# Altium project S7CAS-PLEIADES-CARTE-MERE_P01.PrjPcb (part 3 of 4)

## Sheet S7CAS-PLEIADES-CARTE-MERE_P01_IO.SchDoc
size Tabloid; DocumentNumber: 10; SheetNumber: 10; SheetTotal: 17; Sheet_Name: IO; Size: 11x17
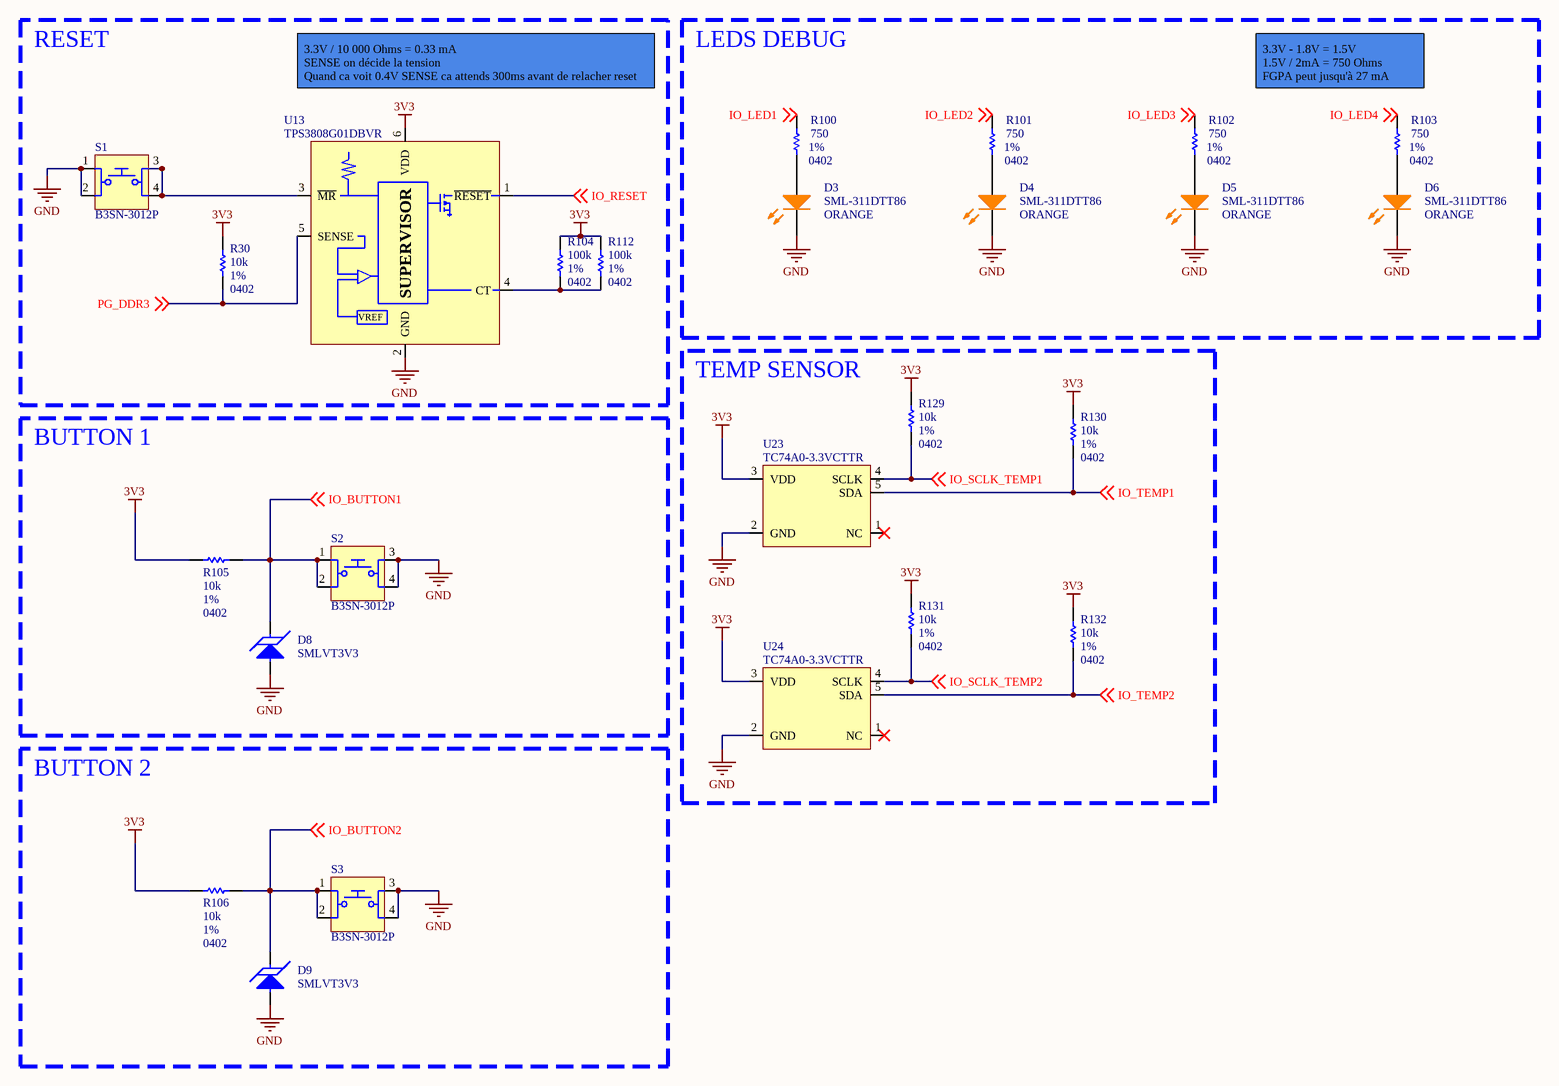
[diagram p9: S7CAS-PLEIADES-CARTE-MERE_P01_IO.SchDoc]

### Parts
D3  SML-311DTT86  value ORANGE  [LED_0603]
D4  SML-311DTT86  value ORANGE  [LED_0603]
D5  SML-311DTT86  value ORANGE  [LED_0603]
D6  SML-311DTT86  value ORANGE  [LED_0603]
D8  SMLVT3V3  [TVS_POW_SMLVT3V3]
D9  SMLVT3V3  [TVS_POW_SMLVT3V3]
R30  value 10k  Package: 0402  Precision: 1%  [RES_0402]  (hidden comment: RES - 0402)
R100  value 750  Package: 0402  Precision: 1%  [RES_0402]  (hidden comment: RES - 0402)
R101  value 750  Package: 0402  Precision: 1%  [RES_0402]  (hidden comment: RES - 0402)
R102  value 750  Package: 0402  Precision: 1%  [RES_0402]  (hidden comment: RES - 0402)
R103  value 750  Package: 0402  Precision: 1%  [RES_0402]  (hidden comment: RES - 0402)
R104  value 100k  Package: 0402  Precision: 1%  [RES_0402]  (hidden comment: RES - 0402)
R105  value 10k  Package: 0402  Precision: 1%  [RES_0402]  (hidden comment: RES - 0402)
R106  value 10k  Package: 0402  Precision: 1%  [RES_0402]  (hidden comment: RES - 0402)
R112  value 100k  Package: 0402  Precision: 1%  [RES_0402]  (hidden comment: RES - 0402)
R129  value 10k  Package: 0402  Precision: 1%  [RES_0402]  (hidden comment: RES - 0402)
R130  value 10k  Package: 0402  Precision: 1%  [RES_0402]  (hidden comment: RES - 0402)
R131  value 10k  Package: 0402  Precision: 1%  [RES_0402]  (hidden comment: RES - 0402)
R132  value 10k  Package: 0402  Precision: 1%  [RES_0402]  (hidden comment: RES - 0402)
S1  B3SN-3012P  [SWI_TACT_B3SN-3012P]
S2  B3SN-3012P  [SWI_TACT_B3SN-3012P]
S3  B3SN-3012P  [SWI_TACT_B3SN-3012P]
U13  TPS3808G01DBVR  [POW_RESET_TPS3808]
U23  TC74A0-3.3VCTTR  [SEN_TEMP_TC74A0-3.3VCTTR]
U24  TC74A0-3.3VCTTR  [SEN_TEMP_TC74A0-3.3VCTTR]

### Blocks framed on the sheet
RESET: R30 R104 R112 S1 U13
LEDS DEBUG: D3-D6 R100-R103
TEMP SENSOR: R129-R132 U23 U24
BUTTON 1: D8 R105 S2
BUTTON 2: D9 R106 S3

### Nets
3V3: R30.2 R104.2 R105.1 R106.1 R112.2 R129.2 R130.2 R131.2 R132.2 U13.6(VDD) U23.3(VDD) U24.3(VDD)  [project net VDD_3V3]
GND: D3.K D4.K D5.K D6.K D8.A D9.A S1.1 S1.2 S2.3 S2.4 S3.3 S3.4 U13.2(GND) U23.2(GND) U24.2(GND)
IO_BUTTON1: D8.K R105.2 S2.1 S2.2 ; off-sheet IO_BUTTON1
IO_BUTTON2: D9.K R106.2 S3.1 S3.2 ; off-sheet IO_BUTTON2
IO_LED1: R100.2 ; off-sheet IO_LED1
IO_LED2: R101.2 ; off-sheet IO_LED2
IO_LED3: R102.2 ; off-sheet IO_LED3
IO_LED4: R103.2 ; off-sheet IO_LED4
IO_RESET: U13.1(~{RESET}) ; off-sheet IO_RESET  [project net PROGRAM_B]
IO_SCLK_TEMP1: R129.1 U23.4(SCLK) ; off-sheet IO_SCLK_TEMP1
IO_SCLK_TEMP2: R131.1 U24.4(SCLK) ; off-sheet IO_SCLK_TEMP2
IO_TEMP1: R130.1 U23.5(SDA) ; off-sheet IO_TEMP1
IO_TEMP2: R132.1 U24.5(SDA) ; off-sheet IO_TEMP2
PG_DDR3: R30.1 U13.5(SENSE) ; off-sheet PG_DDR3
NetD3_A: D3.A R100.1
NetD4_A: D4.A R101.1
NetD5_A: D5.A R102.1
NetD6_A: D6.A R103.1
NetR104_1: R104.1 R112.1 U13.4(CT)
NetS1_3: S1.3 S1.4 U13.3(~{MR})

Not connected (* = marked no-connect by the designer): U23 1(NC)*; U24 1(NC)*

### Notes on the sheet
- 3.3V / 10 000 Ohms = 0.33 mA
  SENSE on décide la tension
  Quand ca voit 0.4V SENSE ca attends 300ms avant de relacher reset
- (near R103) 3.3V - 1.8V = 1.5V
  1.5V / 2mA = 750 Ohms
  FGPA peut jusqu'à 27 mA
- Sheet Name
- Project Title
- Global Project
- Size
- Group
- Revision
- Date
- Sheet
- of
- Filename
- Designers
- (in symbol POW_RESET_TPS3808G01DBVR) SUPERVISOR; VREF

### Library data of the parts
D3-D6 = LED_SML-311DTT86: LED - 611nM ORANGE 2mA - 0603; Voltage: 1.8V; Mfg: ROHM Semiconductor; Power: 44mW; Current: 2mA; HelpURL: http://media.digikey.com/pdf/Data%20Sheets/Rohm%20PDFs/SML-311%20Series.pdf; CreatedBy: Jonathan Bouchard; Temperature: -40°C to 85°C; Package: 0603; Precision: *; Mfg Part Number: SML-311DTT86; Supplier 1: Digikey; Supplier Part Number 1: 511-1303-1-ND
D8 D9 = TVS_POW_SMLVT3V3: TVS - 3.3V 10.3V 600W - DO214AA; Manufacturer #1: STMicroelectronics; Value: Vbr = 4.1V -  Clamp = 10.3V; Voltage Rating: 3.3V Standoff; Current Rating: 200A (Ifsm); Power Max: 600W (Ppp); GRAMS Lib Spec: 2.8; Magnetic Material: UNKNOWN; Polarized: YES; Tolerance: *; HelpURL: https://www.st.com/content/ccc/resource/technical/document/datasheet/da/a4/86/90/17/13/47/7c/CD00000923.pdf/files/CD00000923.pdf/jcr:content/translations/en.CD00000923.pdf; CreatedBy/Date: Jonathan Bouchard - 2019-04-27; VerifiedBy: Nicolas V. (2019-05-06); Temperature: -55°C ~ 175°C (TJ); Package: DO214AA; Manufacturer #2: *; Part Number #2: *; Part Number #1: SMLVT3V3; Supplier 1: Digi-Key; Supplier Part Number 1: 497-2496-1-ND; Cryo: UNKNOWN; Mfg Part Number: SMLVT3V3
R30 R105 R106 R129-R132 = RES - 0402: as R31 on sheet S7CAS-PLEIADES-CARTE-MERE_P01_DDR3; Current: *; CreatedBy: Jonathan Bouchard; Power: 1/16W; Part Number #1: RMCF0402FT10K0
R100-R103 = RES - 0402: 750 Ohms ±0.1% 0.063W, 1/16W Chip Resistor 0402 (1005 Metric) Automotive AEC-Q200 Thin Film; Mfg Part Number: ERA-2ARB751X; Voltage: 50V; Mfg: Panasonic Electronic Components; Current: *; CreatedBy: Jonathan Bouchard; Power: 1/16W
R104 R112 = RES - 0402: 100 kOhms ±1% 0.063W, 1/16W Chip Resistor 0402 (1005 Metric) Moisture Resistant Thick Film; Mfg Part Number: RC0402FR-07100KL; Voltage: 75V; Current: *; CreatedBy: Jonathan Bouchard; Power: 1/16W; Part Number #1: RC0402FR-07100KL
S1-S3 = SWI_TACT_B3SN-3012P_1: SWI - SWITCH TACTILE SPST-NO 0.05A 24V -SMD; Manufacturer #1: Omron Electronics Inc-EMC Div; Current Rating: 50mA; Voltage rating: 24VDC; Polarized: No; Magnetic Material: UNKNOWN; GRAMS Lib Spec: 2.8; Manufacturer #2: *; Power Max: *; Value: SPST-NO; Part Number #1: B3SN-3012P; Part Number #2: *; HelpURL: http://omronfs.omron.com/en_US/ecb/products/pdf/en-b3sn.pdf; Supplier 1: Digi-Key; Supplier Part Number 1: SW261CT-ND; Temperature: -25°C ~ 70°C; Package: SMD; CreatedBy/Date: Olivier Bernard / 5/12/2017; Tolerance: *; VerifiedBy: Caroline Paulin / 11 juillet 2018; Cryo: UNKNOWN; Mfg Part Number: B3SN-3012P
U13 = POW_RESET_TPS3808G01DBVR: POW - VOLT SUPERVISOR ADJ - SOT23-6; Mfg: Texas Instruments; Voltage: *; Current: *; Power: *; Mfg Part Number: TPS3808G01DBVR; HelpURL: http://www.ti.com/lit/ds/symlink/tps3808.pdf; CreatedBy: Jonathan Bouchard; Temperature: -40°C ~ 125°C (TJ); Value: *; Precision: *; Package: SOT23-6; Supplier 1: Digikey; Supplier Part Number 1: 296-17188-6-ND
U23 U24 = SENS_TEMP_TC74A0-3.3VCTTR: SENS - TEMPERATURE SENSOR I2C/SMBUS - SOT23-5; Voltage: 2.7 V ~ 5.5 V; Mfg: Microchip; Precision: ±2°C (±3°C); Current: *; Power: *; Mfg Part Number: TC74A0-3.3VCTTR; HelpURL: http://ww1.microchip.com/downloads/en/DeviceDoc/21462D.pdf; CreatedBy: Jonathan Bouchard; Temperature: -40°C ~ 125°C; Value: *; Package: SOT23-5; Supplier 1: Digikey; Supplier Part Number 1: TC74A0-3.3VCTDKR-ND

## Sheet S7CAS-PLEIADES-CARTE-MERE_P01_FPGA-BANK0.SchDoc
size Tabloid; DocumentNumber: 11; SheetNumber: 11; SheetTotal: 17; Sheet_Name: FPGA - BANK 0; Size: 11x17
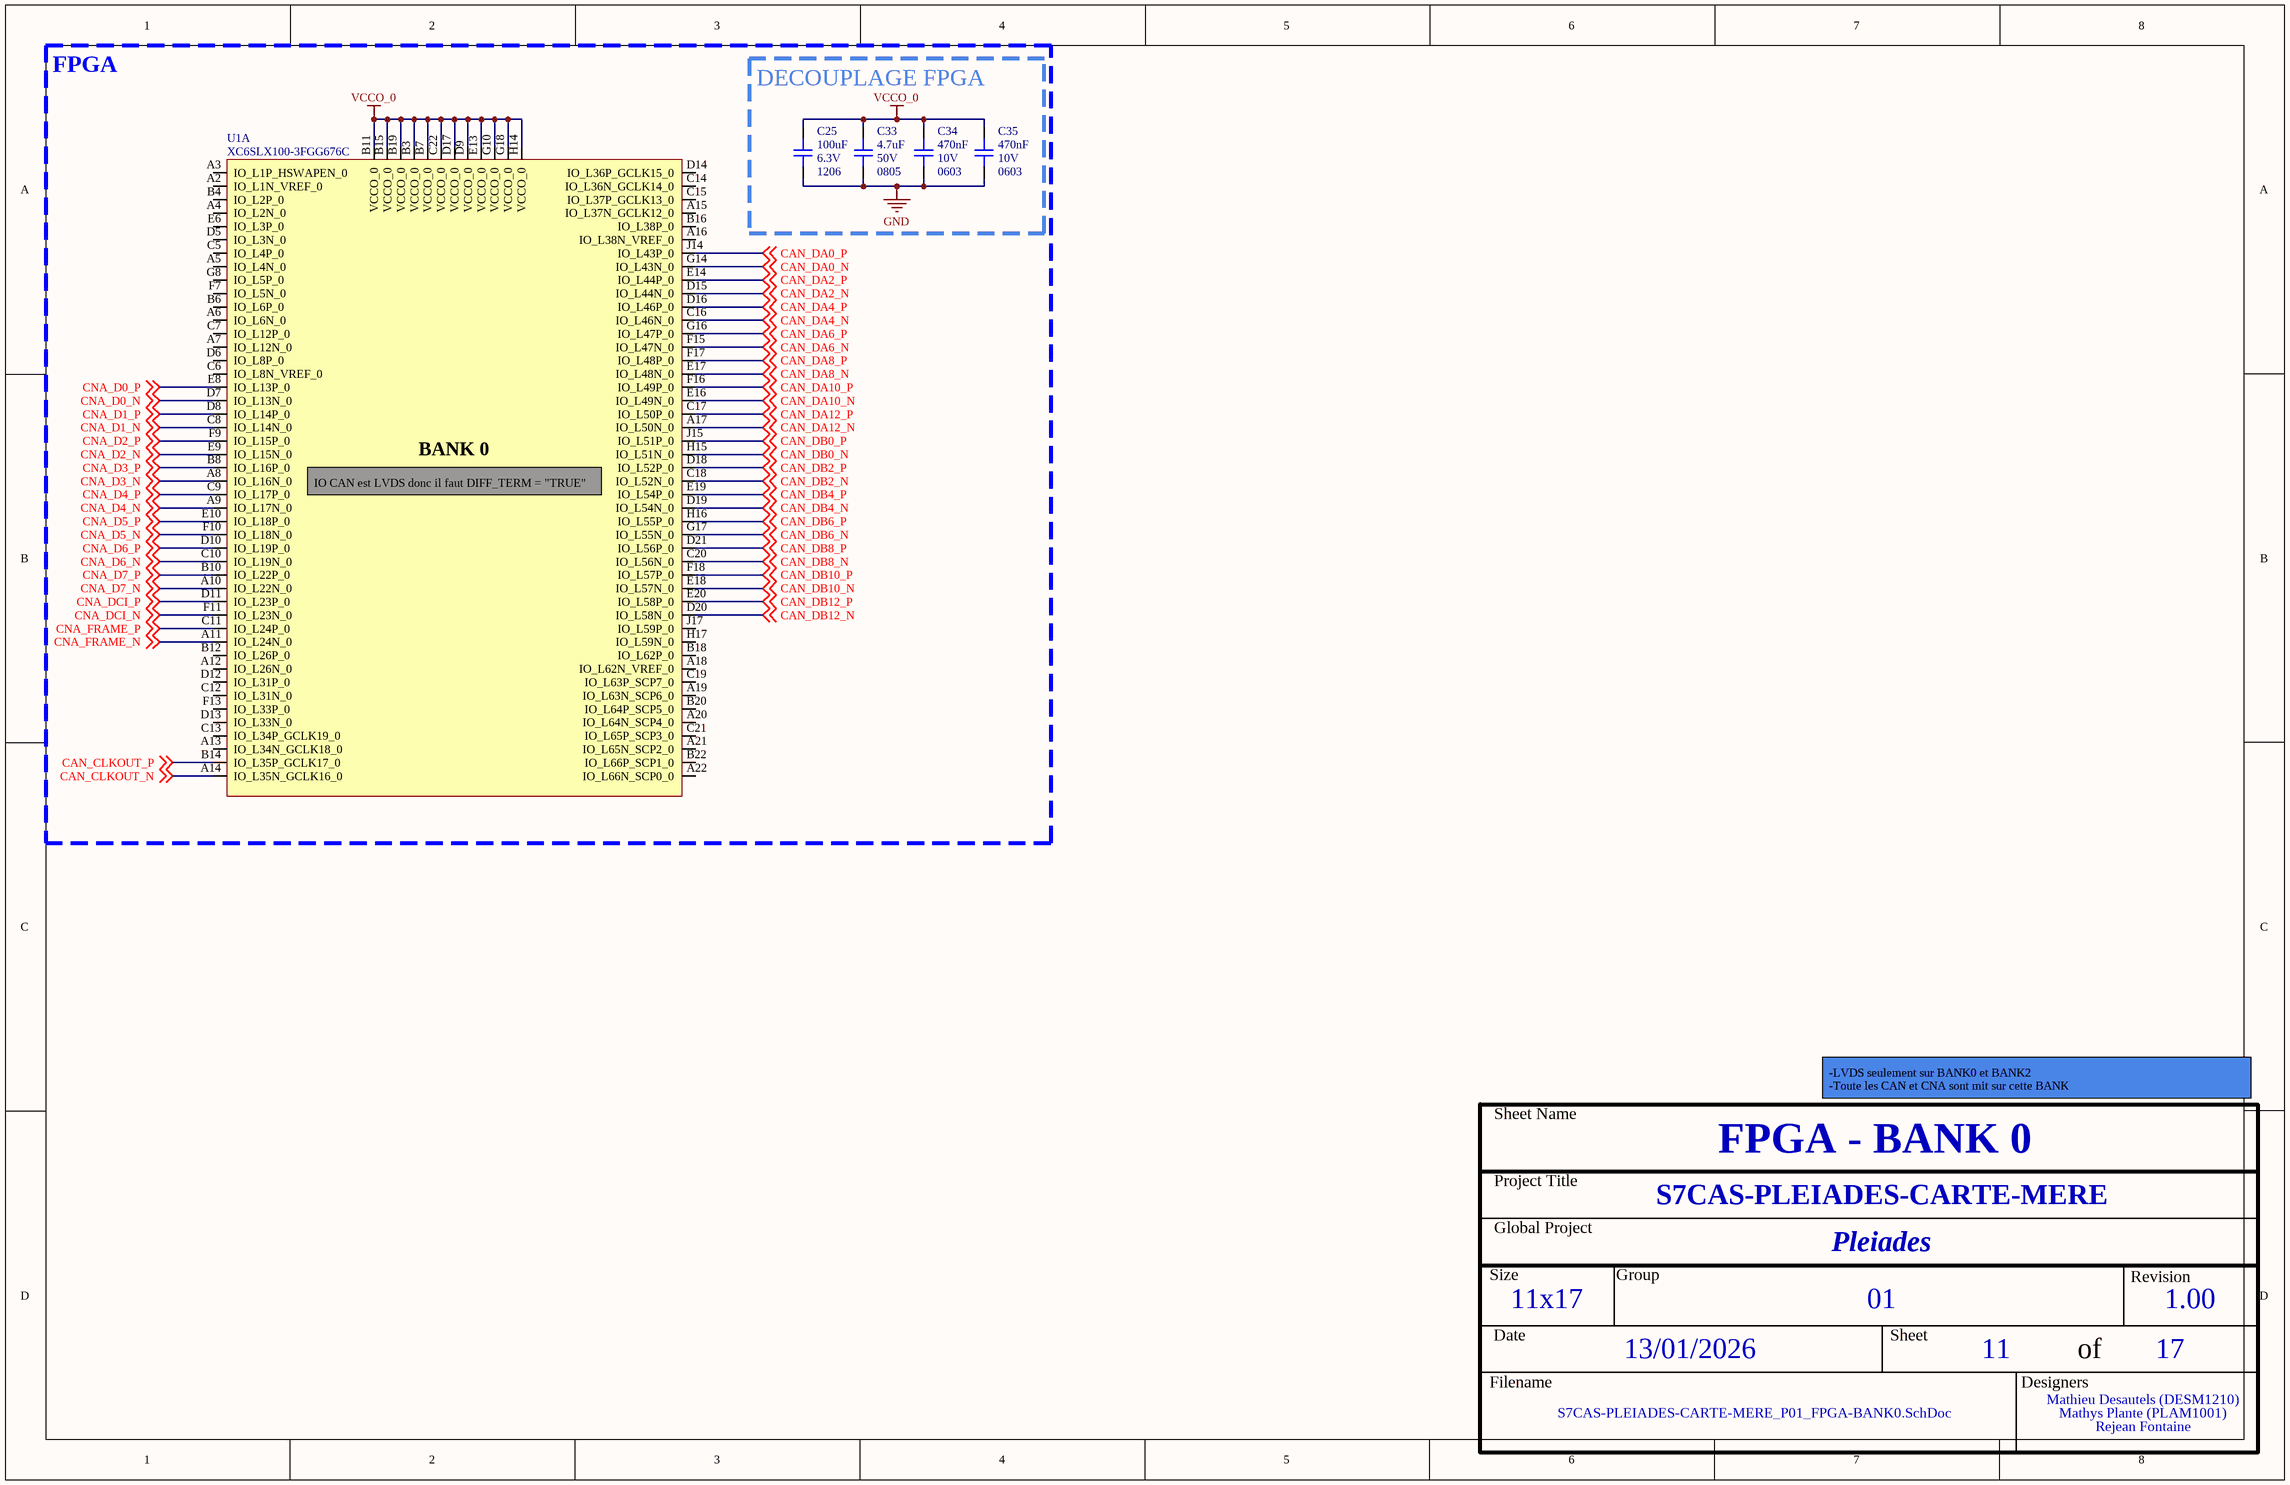
[diagram p10: S7CAS-PLEIADES-CARTE-MERE_P01_FPGA-BANK0.SchDoc]

### Parts
C25  value 100uF  Voltage: 6.3V  Package: 1206  [CAP_1206]  (hidden comment: CAP - 1206)
C33  value 4.7uF  Voltage: 50V  Package: 0805  [CAP_0805]  (hidden comment: CAP - 0805)
C34  value 470nF  Voltage: 10V  Package: 0603  [CAP_0603]  (hidden comment: CAP - 0603)
C35  value 470nF  Voltage: 10V  Package: 0603  [CAP_0603]  (hidden comment: CAP - 0603)
U1  XC6SLX100-3FGG676C  [FPGA_XILINX_FGG676]  (part A of 10)

### Blocks framed on the sheet
FPGA: U1
DECOUPLAGE FPGA: C25 C33-C35

### Nets
GND: C25.1 C33.1 C34.1 C35.1
VCCO_0: C25.2 C33.2 C34.2 C35.2 U1.B3(VCCO_0) U1.B7(VCCO_0) U1.B11(VCCO_0) U1.B15(VCCO_0) U1.B19(VCCO_0) U1.C22(VCCO_0) U1.D9(VCCO_0) U1.D17(VCCO_0) U1.E13(VCCO_0) U1.G10(VCCO_0) U1.G18(VCCO_0) U1.H14(VCCO_0)  [project net VDD_3V3]
CAN_CLKOUT_N: U1.A14(IO_L35N_GCLK16_0) ; off-sheet CAN_CLKOUT_N
CAN_CLKOUT_P: U1.B14(IO_L35P_GCLK17_0) ; off-sheet CAN_CLKOUT_P
CAN_DA0_N: U1.G14(IO_L43N_0) ; off-sheet CAN_DA0_N
CAN_DA0_P: U1.J14(IO_L43P_0) ; off-sheet CAN_DA0_P
CAN_DA2_N: U1.D15(IO_L44N_0) ; off-sheet CAN_DA2_N
CAN_DA2_P: U1.E14(IO_L44P_0) ; off-sheet CAN_DA2_P
CAN_DA4_N: U1.C16(IO_L46N_0) ; off-sheet CAN_DA4_N
CAN_DA4_P: U1.D16(IO_L46P_0) ; off-sheet CAN_DA4_P
CAN_DA6_N: U1.F15(IO_L47N_0) ; off-sheet CAN_DA6_N
CAN_DA6_P: U1.G16(IO_L47P_0) ; off-sheet CAN_DA6_P
CAN_DA8_N: U1.E17(IO_L48N_0) ; off-sheet CAN_DA8_N
CAN_DA8_P: U1.F17(IO_L48P_0) ; off-sheet CAN_DA8_P
CAN_DA10_N: U1.E16(IO_L49N_0) ; off-sheet CAN_DA10_N
CAN_DA10_P: U1.F16(IO_L49P_0) ; off-sheet CAN_DA10_P
CAN_DA12_N: U1.A17(IO_L50N_0) ; off-sheet CAN_DA12_N
CAN_DA12_P: U1.C17(IO_L50P_0) ; off-sheet CAN_DA12_P
CAN_DB0_N: U1.H15(IO_L51N_0) ; off-sheet CAN_DB0_N
CAN_DB0_P: U1.J15(IO_L51P_0) ; off-sheet CAN_DB0_P
CAN_DB2_N: U1.C18(IO_L52N_0) ; off-sheet CAN_DB2_N
CAN_DB2_P: U1.D18(IO_L52P_0) ; off-sheet CAN_DB2_P
CAN_DB4_N: U1.D19(IO_L54N_0) ; off-sheet CAN_DB4_N
CAN_DB4_P: U1.E19(IO_L54P_0) ; off-sheet CAN_DB4_P
CAN_DB6_N: U1.G17(IO_L55N_0) ; off-sheet CAN_DB6_N
CAN_DB6_P: U1.H16(IO_L55P_0) ; off-sheet CAN_DB6_P
CAN_DB8_N: U1.C20(IO_L56N_0) ; off-sheet CAN_DB8_N
CAN_DB8_P: U1.D21(IO_L56P_0) ; off-sheet CAN_DB8_P
CAN_DB10_N: U1.E18(IO_L57N_0) ; off-sheet CAN_DB10_N
CAN_DB10_P: U1.F18(IO_L57P_0) ; off-sheet CAN_DB10_P
CAN_DB12_N: U1.D20(IO_L58N_0) ; off-sheet CAN_DB12_N
CAN_DB12_P: U1.E20(IO_L58P_0) ; off-sheet CAN_DB12_P
CNA_D0_N: U1.D7(IO_L13N_0) ; off-sheet CNA_D0_N
CNA_D0_P: U1.E8(IO_L13P_0) ; off-sheet CNA_D0_P
CNA_D1_N: U1.C8(IO_L14N_0) ; off-sheet CNA_D1_N
CNA_D1_P: U1.D8(IO_L14P_0) ; off-sheet CNA_D1_P
CNA_D2_N: U1.E9(IO_L15N_0) ; off-sheet CNA_D2_N
CNA_D2_P: U1.F9(IO_L15P_0) ; off-sheet CNA_D2_P
CNA_D3_N: U1.A8(IO_L16N_0) ; off-sheet CNA_D3_N
CNA_D3_P: U1.B8(IO_L16P_0) ; off-sheet CNA_D3_P
CNA_D4_N: U1.A9(IO_L17N_0) ; off-sheet CNA_D4_N
CNA_D4_P: U1.C9(IO_L17P_0) ; off-sheet CNA_D4_P
CNA_D5_N: U1.F10(IO_L18N_0) ; off-sheet CNA_D5_N
CNA_D5_P: U1.E10(IO_L18P_0) ; off-sheet CNA_D5_P
CNA_D6_N: U1.C10(IO_L19N_0) ; off-sheet CNA_D6_N
CNA_D6_P: U1.D10(IO_L19P_0) ; off-sheet CNA_D6_P
CNA_D7_N: U1.A10(IO_L22N_0) ; off-sheet CNA_D7_N
CNA_D7_P: U1.B10(IO_L22P_0) ; off-sheet CNA_D7_P
CNA_DCI_N: U1.F11(IO_L23N_0) ; off-sheet CNA_DCI_N
CNA_DCI_P: U1.D11(IO_L23P_0) ; off-sheet CNA_DCI_P
CNA_FRAME_N: U1.A11(IO_L24N_0) ; off-sheet CNA_FRAME_N
CNA_FRAME_P: U1.C11(IO_L24P_0) ; off-sheet CNA_FRAME_P

Not connected (* = marked no-connect by the designer): U1 A2(IO_L1N_VREF_0) A3(IO_L1P_HSWAPEN_0) A4(IO_L2N_0) A5(IO_L4N_0) A6(IO_L6N_0) A7(IO_L12N_0) A12(IO_L26N_0) A13(IO_L34N_GCLK18_0) A15(IO_L37N_GCLK12_0) A16(IO_L38N_VREF_0) A18(IO_L62N_VREF_0) A19(IO_L63N_SCP6_0) A20(IO_L64N_SCP4_0) A21(IO_L65N_SCP2_0) A22(IO_L66N_SCP0_0) B4(IO_L2P_0) B6(IO_L6P_0) B12(IO_L26P_0) B16(IO_L38P_0) B18(IO_L62P_0) B20(IO_L64P_SCP5_0) B22(IO_L66P_SCP1_0) C5(IO_L4P_0) C6(IO_L8N_VREF_0) C7(IO_L12P_0) C12(IO_L31N_0) C13(IO_L34P_GCLK19_0) C14(IO_L36N_GCLK14_0) C15(IO_L37P_GCLK13_0) C19(IO_L63P_SCP7_0) C21(IO_L65P_SCP3_0) D5(IO_L3N_0) D6(IO_L8P_0) D12(IO_L31P_0) D13(IO_L33N_0) D14(IO_L36P_GCLK15_0) E6(IO_L3P_0) F7(IO_L5N_0) F13(IO_L33P_0) G8(IO_L5P_0) H17(IO_L59N_0) J17(IO_L59P_0)

### Notes on the sheet
- (near U1) IO CAN est LVDS donc il faut DIFF_TERM = "TRUE"
- -LVDS seulement sur BANK0 et BANK2
  -Toute les CAN et CNA sont mit sur cette BANK
- Sheet Name
- Project Title
- Global Project
- Size
- Group
- Revision
- Date
- Sheet
- of
- Filename
- Designers
- (in symbol FPGA_XC6SLX100-3FGG676C, part A) BANK 0

### Library data of the parts
C25 = CAP - 1206: 100 µF ±20% 6.3V Ceramic Capacitor X6T 1206 (3216 Metric); Mfg Part Number: GRM31CD80J107MEA8K; Mfg: Murata Electronics; Current: *; CreatedBy: Jonathan Bouchard; Power: *; Precision: 20%
C33 = CAP - 0805: as C117 on sheet S7CAS-PLEIADES-CARTE-MERE_P01_DDR3; Current: *; CreatedBy: Jonathan Bouchard; Power: *; Precision: 10%
C34 C35 = CAP - 0603: Mfg Part Number: C0603X474K8RAC; Precision: 10%; Current: *; CreatedBy: Jonathan Bouchard; Power: *
U1 = FPGA_XC6SLX100-3FGG676C: FPGA - XILINX SPARTAN 6 480 I/O - BGA-676; Voltage: 1.14 V ~ 1.26 V; Current: *; Power: *; Mfg: Xilinx; Mfg Part Number: XC6SLX100-3FGG676C; HelpURL: https://www.xilinx.com/support/documentation/data_sheets/ds162.pdf; CreatedBy: Jonathan Bouchard; Temperature: 0°C ~ 85°C (TJ); Value: *; Precision: *; Package: BGA-676; Supplier 1: Digikey; Supplier Part Number 1: 122-1760-ND; Part Number #1: XC6SLX100-3FGG676C

## Sheet S7CAS-PLEIADES-CARTE-MERE_P01_FPGA-BANK1.SchDoc
size Tabloid; DocumentNumber: 12; SheetNumber: 12; SheetTotal: 17; Sheet_Name: FPGA - BANK 1; Size: 11x17
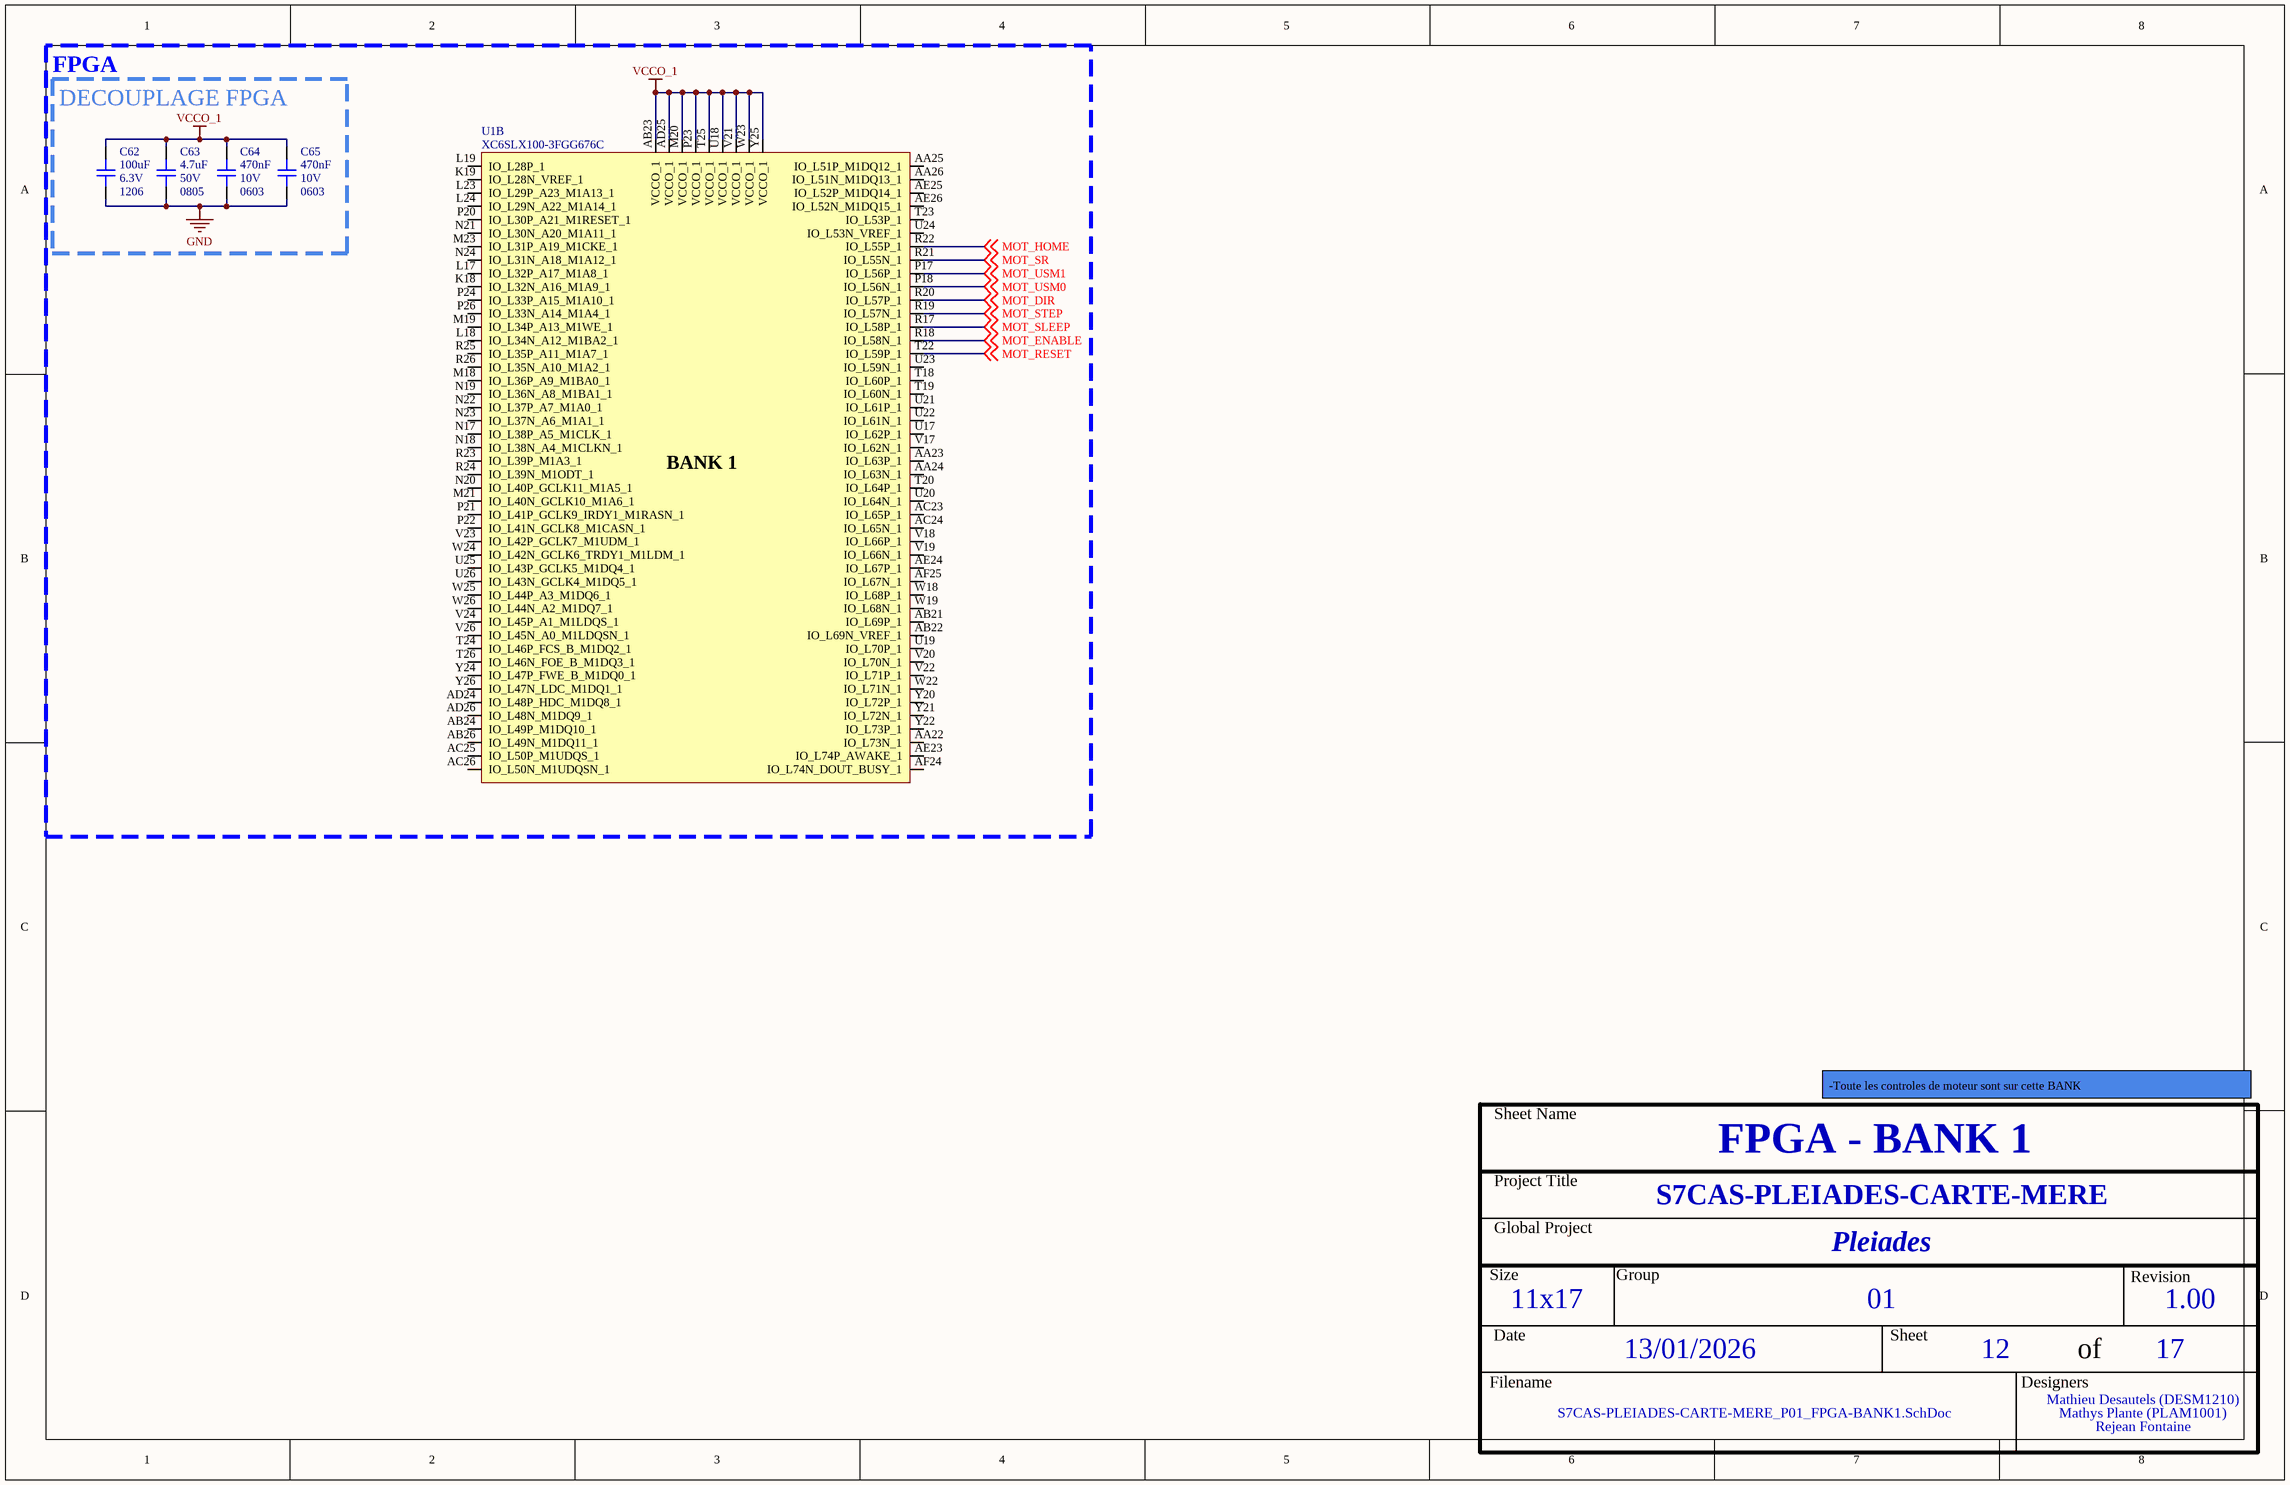
[diagram p11: S7CAS-PLEIADES-CARTE-MERE_P01_FPGA-BANK1.SchDoc]

### Parts
C62  value 100uF  Voltage: 6.3V  Package: 1206  [CAP_1206]  (hidden comment: CAP - 1206)
C63  value 4.7uF  Voltage: 50V  Package: 0805  [CAP_0805]  (hidden comment: CAP - 0805)
C64  value 470nF  Voltage: 10V  Package: 0603  [CAP_0603]  (hidden comment: CAP - 0603)
C65  value 470nF  Voltage: 10V  Package: 0603  [CAP_0603]  (hidden comment: CAP - 0603)
U1  XC6SLX100-3FGG676C  [FPGA_XILINX_FGG676]  (part B of 10)

### Nets
GND: C62.1 C63.1 C64.1 C65.1
VCCO_1: C62.2 C63.2 C64.2 C65.2 U1.AB23(VCCO_1) U1.AD25(VCCO_1) U1.M20(VCCO_1) U1.P23(VCCO_1) U1.T25(VCCO_1) U1.U18(VCCO_1) U1.V21(VCCO_1) U1.W23(VCCO_1) U1.Y25(VCCO_1)  [project net VDD_3V3]
MOT_DIR: U1.R20(IO_L57P_1) ; off-sheet MOT_DIR
MOT_ENABLE: U1.R18(IO_L58N_1) ; off-sheet MOT_ENABLE
MOT_HOME: U1.R22(IO_L55P_1) ; off-sheet MOT_HOME
MOT_RESET: U1.T22(IO_L59P_1) ; off-sheet MOT_RESET
MOT_SLEEP: U1.R17(IO_L58P_1) ; off-sheet MOT_SLEEP
MOT_SR: U1.R21(IO_L55N_1) ; off-sheet MOT_SR
MOT_STEP: U1.R19(IO_L57N_1) ; off-sheet MOT_STEP
MOT_USM0: U1.P18(IO_L56N_1) ; off-sheet MOT_USM0
MOT_USM1: U1.P17(IO_L56P_1) ; off-sheet MOT_USM1

Not connected (* = marked no-connect by the designer): U1 AA22(IO_L73N_1) AA23(IO_L63P_1) AA24(IO_L63N_1) AA25(IO_L51P_M1DQ12_1) AA26(IO_L51N_M1DQ13_1) AB21(IO_L69P_1) AB22(IO_L69N_VREF_1) AB24(IO_L49P_M1DQ10_1) AB26(IO_L49N_M1DQ11_1) AC23(IO_L65P_1) AC24(IO_L65N_1) AC25(IO_L50P_M1UDQS_1) AC26(IO_L50N_M1UDQSN_1) AD24(IO_L48P_HDC_M1DQ8_1) AD26(IO_L48N_M1DQ9_1) AE23(IO_L74P_AWAKE_1) AE24(IO_L67P_1) AE25(IO_L52P_M1DQ14_1) AE26(IO_L52N_M1DQ15_1) AF24(IO_L74N_DOUT_BUSY_1) AF25(IO_L67N_1) K18(IO_L32N_A16_M1A9_1) K19(IO_L28N_VREF_1) L17(IO_L32P_A17_M1A8_1) L18(IO_L34N_A12_M1BA2_1) L19(IO_L28P_1) L23(IO_L29P_A23_M1A13_1) L24(IO_L29N_A22_M1A14_1) M18(IO_L36P_A9_M1BA0_1) M19(IO_L34P_A13_M1WE_1) M21(IO_L40N_GCLK10_M1A6_1) M23(IO_L31P_A19_M1CKE_1) N17(IO_L38P_A5_M1CLK_1) N18(IO_L38N_A4_M1CLKN_1) N19(IO_L36N_A8_M1BA1_1) N20(IO_L40P_GCLK11_M1A5_1) N21(IO_L30N_A20_M1A11_1) N22(IO_L37P_A7_M1A0_1) N23(IO_L37N_A6_M1A1_1) N24(IO_L31N_A18_M1A12_1) P20(IO_L30P_A21_M1RESET_1) P21(IO_L41P_GCLK9_IRDY1_M1RASN_1) P22(IO_L41N_GCLK8_M1CASN_1) P24(IO_L33P_A15_M1A10_1) P26(IO_L33N_A14_M1A4_1) R23(IO_L39P_M1A3_1) R24(IO_L39N_M1ODT_1) R25(IO_L35P_A11_M1A7_1) R26(IO_L35N_A10_M1A2_1) T18(IO_L60P_1) T19(IO_L60N_1) T20(IO_L64P_1) T23(IO_L53P_1) T24(IO_L46P_FCS_B_M1DQ2_1) T26(IO_L46N_FOE_B_M1DQ3_1) U17(IO_L62P_1) U19(IO_L70P_1) U20(IO_L64N_1) U21(IO_L61P_1) U22(IO_L61N_1) U23(IO_L59N_1) U24(IO_L53N_VREF_1) U25(IO_L43P_GCLK5_M1DQ4_1) U26(IO_L43N_GCLK4_M1DQ5_1) V17(IO_L62N_1) V18(IO_L66P_1) V19(IO_L66N_1) V20(IO_L70N_1) V22(IO_L71P_1) V23(IO_L42P_GCLK7_M1UDM_1) V24(IO_L45P_A1_M1LDQS_1) V26(IO_L45N_A0_M1LDQSN_1) W18(IO_L68P_1) W19(IO_L68N_1) W22(IO_L71N_1) W24(IO_L42N_GCLK6_TRDY1_M1LDM_1) W25(IO_L44P_A3_M1DQ6_1) W26(IO_L44N_A2_M1DQ7_1) Y20(IO_L72P_1) Y21(IO_L72N_1) Y22(IO_L73P_1) Y24(IO_L47P_FWE_B_M1DQ0_1) Y26(IO_L47N_LDC_M1DQ1_1)

### Notes on the sheet
- FPGA
- DECOUPLAGE FPGA
- -Toute les controles de moteur sont sur cette BANK
- Sheet Name
- Project Title
- Global Project
- Size
- Group
- Revision
- Date
- Sheet
- of
- Filename
- Designers
- (in symbol FPGA_XC6SLX100-3FGG676C, part B) BANK 1

### Library data of the parts
C62 = CAP - 1206: as C25 on sheet S7CAS-PLEIADES-CARTE-MERE_P01_FPGA-BANK0; Current: *; CreatedBy: Jonathan Bouchard; Power: *; Precision: 20%
C63 = CAP - 0805: as C117 on sheet S7CAS-PLEIADES-CARTE-MERE_P01_DDR3; Current: *; CreatedBy: Jonathan Bouchard; Power: *; Precision: 10%
C64 C65 = CAP - 0603: as C34 on sheet S7CAS-PLEIADES-CARTE-MERE_P01_FPGA-BANK0; Current: *; CreatedBy: Jonathan Bouchard; Power: *
U1 = FPGA_XC6SLX100-3FGG676C: as U1 on sheet S7CAS-PLEIADES-CARTE-MERE_P01_FPGA-BANK0; Current: *; Power: *; Mfg: Xilinx; Mfg Part Number: XC6SLX100-3FGG676C; HelpURL: https://www.xilinx.com/support/documentation/data_sheets/ds162.pdf; CreatedBy: Jonathan Bouchard; Temperature: 0°C ~ 85°C (TJ); Value: *; Precision: *; Package: BGA-676; Supplier 1: Digikey; Supplier Part Number 1: 122-1760-ND; Part Number #1: XC6SLX100-3FGG676C

## Sheet S7CAS-PLEIADES-CARTE-MERE_P01_FPGA-BANK2.SchDoc
size Tabloid; DocumentNumber: 13; SheetNumber: 13; SheetTotal: 17; Sheet_Name: FPGA - BANK 2; Size: 11x17
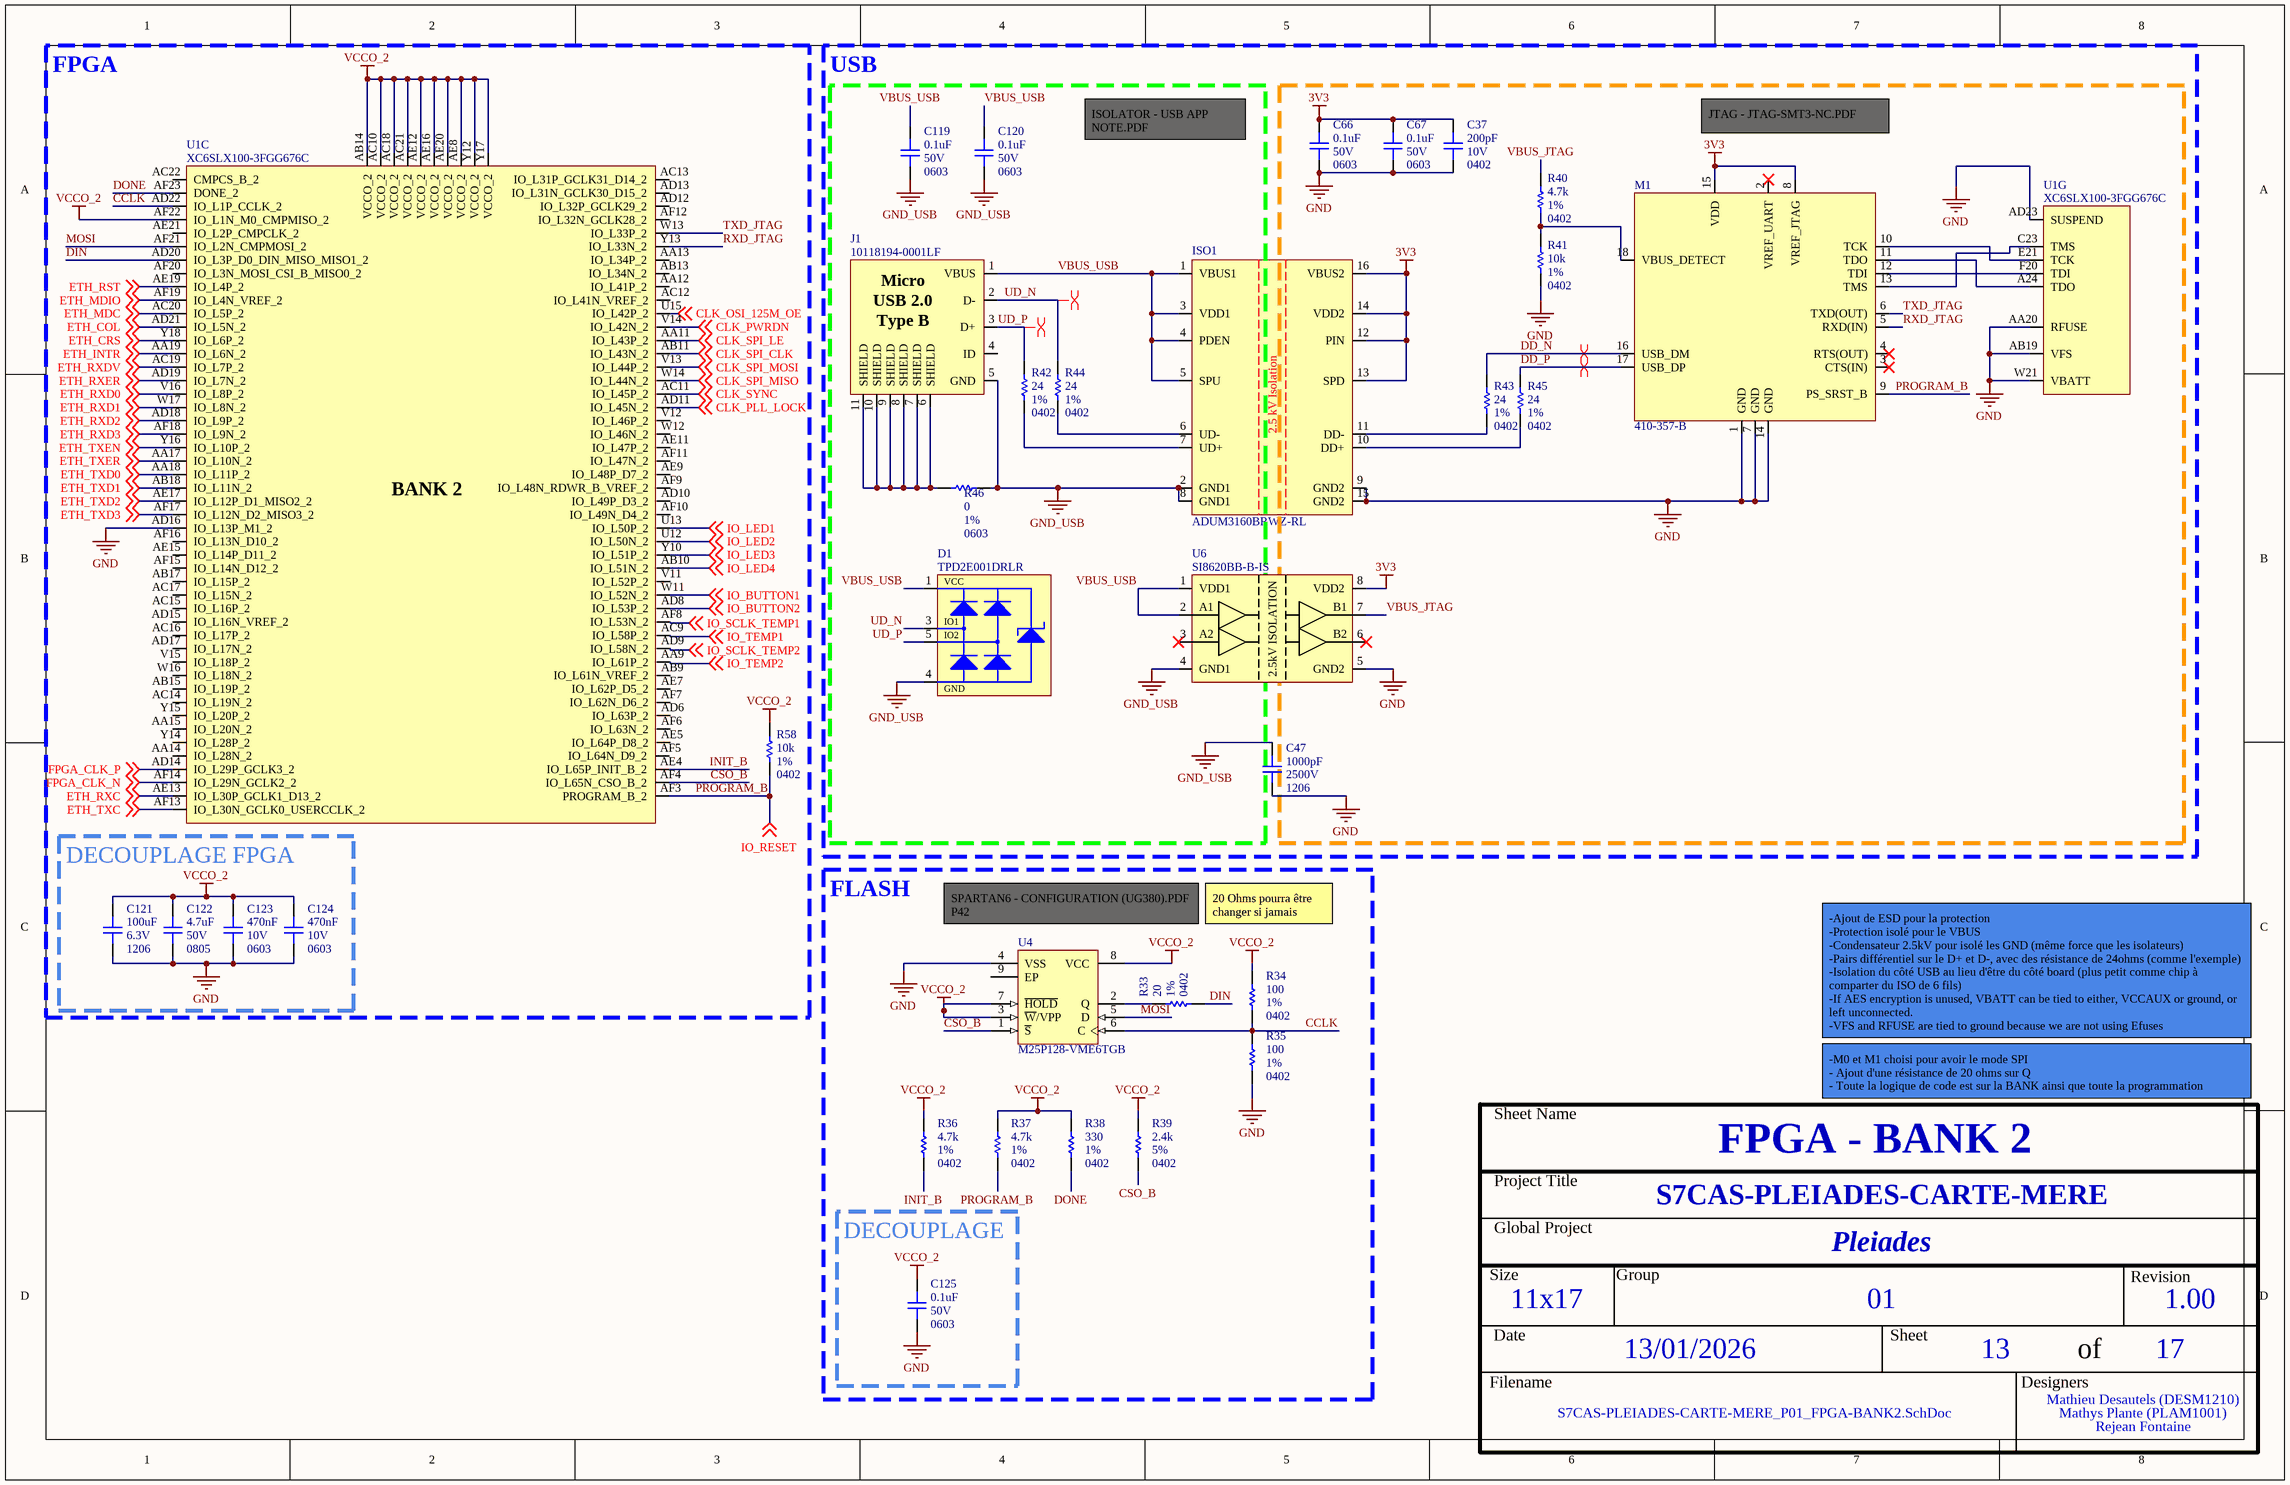
[diagram p12: S7CAS-PLEIADES-CARTE-MERE_P01_FPGA-BANK2.SchDoc]

### Parts
C37  value 200pF  Voltage: 10V  Package: 0402  [CAP_0402]  (hidden comment: CAP - 0402)
C47  value 1000pF  Voltage: 2500V  Package: 1206  [CAP_1206]  (hidden comment: CAP - 1206)
C66  value 0.1uF  Voltage: 50V  Package: 0603  [CAP_0603]  (hidden comment: CAP - 0603)
C67  value 0.1uF  Voltage: 50V  Package: 0603  [CAP_0603]  (hidden comment: CAP - 0603)
C119  value 0.1uF  Voltage: 50V  Package: 0603  [CAP_0603]  (hidden comment: CAP - 0603)
C120  value 0.1uF  Voltage: 50V  Package: 0603  [CAP_0603]  (hidden comment: CAP - 0603)
C121  value 100uF  Voltage: 6.3V  Package: 1206  [CAP_1206]  (hidden comment: CAP - 1206)
C122  value 4.7uF  Voltage: 50V  Package: 0805  [CAP_0805]  (hidden comment: CAP - 0805)
C123  value 470nF  Voltage: 10V  Package: 0603  [CAP_0603]  (hidden comment: CAP - 0603)
C124  value 470nF  Voltage: 10V  Package: 0603  [CAP_0603]  (hidden comment: CAP - 0603)
C125  value 0.1uF  Voltage: 50V  Package: 0603  [CAP_0603]  (hidden comment: CAP - 0603)
D1  TPD2E001DRLR  [TVS_USB_TPD2E001DRLR]
ISO1  ADUM3160BRWZ-RL  [ISO_ADUM3160BRWZ-RL]
J1  10118194-0001LF  [CON_USB_10118194-0001LF]
M1  410-357-B  [MOD_JTAG_410-357-B]
R33  value 20  Package: 0402  Precision: 1%  [RES_0402]  (hidden comment: RES - 0402)
R34  value 100  Package: 0402  Precision: 1%  [RES_0402]  (hidden comment: RES - 0402)
R35  value 100  Package: 0402  Precision: 1%  [RES_0402]  (hidden comment: RES - 0402)
R36  value 4.7k  Package: 0402  Precision: 1%  [RES_0402]  (hidden comment: RES - 0402)
R37  value 4.7k  Package: 0402  Precision: 1%  [RES_0402]  (hidden comment: RES - 0402)
R38  value 330  Package: 0402  Precision: 1%  [RES_0402]  (hidden comment: RES - 0402)
R39  value 2.4k  Package: 0402  Precision: 5%  [RES_0402]  (hidden comment: RES - 0402)
R40  value 4.7k  Package: 0402  Precision: 1%  [RES_0402]  (hidden comment: RES - 0402)
R41  value 10k  Package: 0402  Precision: 1%  [RES_0402]  (hidden comment: RES - 0402)
R42  value 24  Package: 0402  Precision: 1%  [RES_0402]  (hidden comment: RES - 0402)
R43  value 24  Package: 0402  Precision: 1%  [RES_0402]  (hidden comment: RES - 0402)
R44  value 24  Package: 0402  Precision: 1%  [RES_0402]  (hidden comment: RES - 0402)
R45  value 24  Package: 0402  Precision: 1%  [RES_0402]  (hidden comment: RES - 0402)
R46  value 0  Package: 0603  Precision: 1%  [RES_0603]  (hidden comment: RES - 0603)
R58  value 10k  Package: 0402  Precision: 1%  [RES_0402]  (hidden comment: RES - 0402)
U1  XC6SLX100-3FGG676C  [FPGA_XILINX_FGG676]  (parts C,G of 10)
U4  M25P128-VME6TGB  [MICT-VDFPN-8_M]
U6  SI8620BB-B-IS  [ISO_SI8620BB-B-IS]

### Blocks framed on the sheet
FPGA: R58 U1
USB: C119 C120 D1 J1 R42 R44 R46
DECOUPLAGE FPGA: C121-C124
FLASH: R33-R39 U4
DECOUPLAGE: C125

### Nets
3V3: C37.2 C66.2 C67.2 C121.2 C122.2 C123.2 C124.2 C125.2 ISO1.12(PIN) ISO1.13(SPD) ISO1.14(VDD2) ISO1.16(VBUS2) M1.8(VREF_JTAG) M1.15(VDD) R34.2 R36.2 R37.2 R38.2 R39.2 R58.2 U1.AB14(VCCO_2) U1.AC10(VCCO_2) U1.AC18(VCCO_2) U1.AC21(VCCO_2) U1.AE8(VCCO_2) U1.AE12(VCCO_2) U1.AE16(VCCO_2) U1.AE20(VCCO_2) U1.AF22(IO_L1N_M0_CMPMISO_2) U1.Y12(VCCO_2) U1.Y17(VCCO_2) U4.3(~{W}/VPP) U4.7(~{HOLD}) U4.8(VCC) U6.8(VDD2)  [also labelled VCCO_2]  [project net VDD_3V3]
GND: C37.1 C47.1 C66.1 C67.1 C121.1 C122.1 C123.1 C124.1 C125.1 ISO1.9(GND2) ISO1.15(GND2) M1.1(GND) M1.7(GND) M1.14(GND) R35.1 R41.1 U1.AA20(RFUSE) U1.AB19(VFS) U1.AD16(IO_L13P_M1_2) U1.AD23(SUSPEND) U1.W21(VBATT) U4.4(VSS) U6.5(GND2)
GND_USB: C47.2 C119.1 C120.1 D1.4(GND) ISO1.2(GND1) ISO1.8(GND1) J1.5(GND) R46.1 U6.4(GND1)
CCLK: R34.1 R35.2 U1.AD22(IO_L1P_CCLK_2) U4.6(C)
CLK_OSI_125M_OE: U1.U15(IO_L42P_2) ; off-sheet CLK_OSI_125M_OE
CLK_PLL_LOCK: U1.AD11(IO_L45N_2) ; off-sheet CLK_PLL_LOCK
CLK_PWRDN: U1.V14(IO_L42N_2) ; off-sheet CLK_PWRDN
CLK_SPI_CLK: U1.AB11(IO_L43N_2) ; off-sheet CLK_SPI_CLK
CLK_SPI_LE: U1.AA11(IO_L43P_2) ; off-sheet CLK_SPI_LE
CLK_SPI_MISO: U1.W14(IO_L44N_2) ; off-sheet CLK_SPI_MISO
CLK_SPI_MOSI: U1.V13(IO_L44P_2) ; off-sheet CLK_SPI_MOSI
CLK_SYNC: U1.AC11(IO_L45P_2) ; off-sheet CLK_SYNC
CSO_B: R39.1 U1.AF4(IO_L65N_CSO_B_2) U4.1(~{S})
DD_N: M1.16(USB_DM) R43.2
DD_P: M1.17(USB_DP) R45.2
DIN: R33.1 U1.AD20(IO_L3P_D0_DIN_MISO_MISO1_2)
DONE: R38.1 U1.AF23(DONE_2)
ETH_COL: U1.AD21(IO_L5N_2) ; off-sheet ETH_COL
ETH_CRS: U1.Y18(IO_L6P_2) ; off-sheet ETH_CRS
ETH_INTR: U1.AA19(IO_L6N_2) ; off-sheet ETH_INTR
ETH_MDC: U1.AC20(IO_L5P_2) ; off-sheet ETH_MDC
ETH_MDIO: U1.AF19(IO_L4N_VREF_2) ; off-sheet ETH_MDIO
ETH_RST: U1.AE19(IO_L4P_2) ; off-sheet ETH_RST
ETH_RXC: U1.AE13(IO_L30P_GCLK1_D13_2) ; off-sheet ETH_RXC
ETH_RXD0: U1.V16(IO_L8P_2) ; off-sheet ETH_RXD0
ETH_RXD1: U1.W17(IO_L8N_2) ; off-sheet ETH_RXD1
ETH_RXD2: U1.AD18(IO_L9P_2) ; off-sheet ETH_RXD2
ETH_RXD3: U1.AF18(IO_L9N_2) ; off-sheet ETH_RXD3
ETH_RXDV: U1.AC19(IO_L7P_2) ; off-sheet ETH_RXDV
ETH_RXER: U1.AD19(IO_L7N_2) ; off-sheet ETH_RXER
ETH_TXC: U1.AF13(IO_L30N_GCLK0_USERCCLK_2) ; off-sheet ETH_TXC
ETH_TXD0: U1.AA18(IO_L11P_2) ; off-sheet ETH_TXD0
ETH_TXD1: U1.AB18(IO_L11N_2) ; off-sheet ETH_TXD1
ETH_TXD2: U1.AE17(IO_L12P_D1_MISO2_2) ; off-sheet ETH_TXD2
ETH_TXD3: U1.AF17(IO_L12N_D2_MISO3_2) ; off-sheet ETH_TXD3
ETH_TXEN: U1.Y16(IO_L10P_2) ; off-sheet ETH_TXEN
ETH_TXER: U1.AA17(IO_L10N_2) ; off-sheet ETH_TXER
FPGA_CLK_N: U1.AF14(IO_L29N_GCLK2_2) ; off-sheet FPGA_CLK_N
FPGA_CLK_P: U1.AD14(IO_L29P_GCLK3_2) ; off-sheet FPGA_CLK_P
INIT_B: R36.1 U1.AE4(IO_L65P_INIT_B_2)
IO_BUTTON1: U1.W11(IO_L52N_2) ; off-sheet IO_BUTTON1
IO_BUTTON2: U1.AD8(IO_L53P_2) ; off-sheet IO_BUTTON2
IO_LED1: U1.U13(IO_L50P_2) ; off-sheet IO_LED1
IO_LED2: U1.U12(IO_L50N_2) ; off-sheet IO_LED2
IO_LED3: U1.Y10(IO_L51P_2) ; off-sheet IO_LED3
IO_LED4: U1.AB10(IO_L51N_2) ; off-sheet IO_LED4
IO_SCLK_TEMP1: U1.AF8(IO_L53N_2) ; off-sheet IO_SCLK_TEMP1
IO_SCLK_TEMP2: U1.AD9(IO_L58N_2) ; off-sheet IO_SCLK_TEMP2
IO_TEMP1: U1.AC9(IO_L58P_2) ; off-sheet IO_TEMP1
IO_TEMP2: U1.AA9(IO_L61P_2) ; off-sheet IO_TEMP2
MOSI: U1.AF21(IO_L2N_CMPMOSI_2) U4.5(D)
PROGRAM_B: M1.9(PS_SRST_B) R37.1 R58.1 U1.AF3(PROGRAM_B_2) ; off-sheet IO_RESET  [also labelled IO_RESET]
RXD_JTAG: M1.5(RXD(IN)) U1.Y13(IO_L33N_2)
TXD_JTAG: M1.6(TXD(OUT)) U1.W13(IO_L33P_2)
UD_N: D1.3(IO1) J1.2(D-) R44.2
UD_P: D1.5(IO2) J1.3(D+) R42.2
VBUS_JTAG: R40.2 U6.7(B1)
VBUS_USB: C119.2 C120.2 D1.1(VCC) ISO1.1(VBUS1) ISO1.3(VDD1) ISO1.4(PDEN) ISO1.5(SPU) J1.1(VBUS) U6.1(VDD1) U6.2(A1)
NetISO1_6: ISO1.6(UD-) R44.1
NetISO1_7: ISO1.7(UD+) R42.1
NetISO1_10: ISO1.10(DD+) R45.1
NetISO1_11: ISO1.11(DD-) R43.1
NetJ1_6: J1.6(SHIELD) J1.7(SHIELD) J1.8(SHIELD) J1.9(SHIELD) J1.10(SHIELD) J1.11(SHIELD) R46.2
NetM1_10: M1.10(TCK) U1.E21(TCK)
NetM1_11: M1.11(TDO) U1.A24(TDO)
NetM1_12: M1.12(TDI) U1.F20(TDI)
NetM1_13: M1.13(TMS) U1.C23(TMS)
NetM1_18: M1.18(VBUS_DETECT) R40.1 R41.2
NetR33_2: R33.2 U4.2(Q)

Not connected (* = marked no-connect by the designer): D1 2(NC); J1 4(ID); M1 2(VREF_UART)* 3(CTS(IN))* 4(RTS(OUT))*; U1 AA12(IO_L41P_2) AA13(IO_L34P_2) AA14(IO_L28N_2) AA15(IO_L20N_2) AB9(IO_L61N_VREF_2) AB13(IO_L34N_2) AB15(IO_L19P_2) AB17(IO_L15P_2) AC12(IO_L41N_VREF_2) AC13(IO_L31P_GCLK31_D14_2) AC14(IO_L19N_2) AC15(IO_L16P_2) AC16(IO_L17P_2) AC17(IO_L15N_2) AC22(CMPCS_B_2) AD6(IO_L63P_2) AD10(IO_L49P_D3_2) AD12(IO_L32P_GCLK29_2) AD13(IO_L31N_GCLK30_D15_2) AD15(IO_L16N_VREF_2) AD17(IO_L17N_2) AE5(IO_L64P_D8_2) AE7(IO_L62P_D5_2) AE9(IO_L48P_D7_2) AE11(IO_L47P_2) AE15(IO_L14P_D11_2) AE21(IO_L2P_CMPCLK_2) AF5(IO_L64N_D9_2) AF6(IO_L63N_2) AF7(IO_L62N_D6_2) AF9(IO_L48N_RDWR_B_VREF_2) AF10(IO_L49N_D4_2) AF11(IO_L47N_2) AF12(IO_L32N_GCLK28_2) AF15(IO_L14N_D12_2) AF16(IO_L13N_D10_2) AF20(IO_L3N_MOSI_CSI_B_MISO0_2) V11(IO_L52P_2) V12(IO_L46P_2) V15(IO_L18P_2) W12(IO_L46N_2) W16(IO_L18N_2) Y14(IO_L28P_2) Y15(IO_L20P_2); U4 9(EP); U6 3(A2)* 6(B2)*

### Layout directives
differential pair; net class USB: DD_N, DD_P, UD_N, UD_P

### Notes on the sheet
- ISOLATOR - USB APP NOTE.PDF
- JTAG - JTAG-SMT3-NC.PDF
- (near U4) SPARTAN6 - CONFIGURATION (UG380).PDF
  P42
- 20 Ohms pourra être changer si jamais
- -Ajout de ESD pour la protection
  -Protection isolé pour le VBUS
  -Condensateur 2.5kV pour isolé les GND (même force que les isolateurs)
  -Pairs différentiel sur le D+ et D-, avec des résistance de 24ohms (comme l'exemple)
  -Isolation du côté USB au lieu d'être du côté board (plus petit comme chip à comparter du ISO de 6 fils)
  -If AES encryption is unused, VBATT can be tied to either, VCCAUX or ground, or left unconnected.
  -VFS and RFUSE are tied to ground because we are not using Efuses
- -M0 et M1 choisi pour avoir le mode SPI
  - Ajout d'une résistance de 20 ohms sur Q
  - Toute la logique de code est sur la BANK ainsi que toute la programmation
- Sheet Name
- Project Title
- Global Project
- Size
- Group
- Revision
- Date
- Sheet
- of
- Filename
- Designers
- (in symbol CON_USB_10118194-0001LF) Micro; USB 2.0; Type B
- (in symbol FPGA_XC6SLX100-3FGG676C, part C) BANK 2
- (in symbol ISO_ADUM3160BRWZ-RL) 2.5 kV Isolation
- (in symbol ISO_SI8620BB-B-IS) 2.5kV ISOLATION

### Library data of the parts
C37 = CAP - 0402: 200 pF ±10% 10V Ceramic Capacitor X8R 0402 (1005 Metric); Mfg Part Number: C0402C201K8HACTU; Mfg: KEMET; Current: *; CreatedBy: Jonathan Bouchard; Power: *; Precision: 10%; Part Number #1: C0402C201K8HACTU
C47 = CAP - 1206: 1000 pF ±10% 2500V (2.5kV) Ceramic Capacitor X7R 1206 (3216 Metric); Mfg Part Number: CC1206KKX7RSAB102; Mfg: YAGEO; Current: *; CreatedBy: Jonathan Bouchard; Power: *; Precision: 10%; Part Number #1: CC1206KKX7RSAB102
C66 C67 C119 C120 C125 = CAP - 0603: 0.1 µF ±10% 50V Ceramic Capacitor X7R 0603 (1608 Metric); Mfg Part Number: C0603C104K5RACTU; Mfg: KEMET; Current: *; CreatedBy: Jonathan Bouchard; Power: *; Precision: 10%
C121 = CAP - 1206: 100 µF ±20% 6.3V Ceramic Capacitor X6T 1206 (3216 Metric); Mfg Part Number: GRM31CD80J107MEA8K; Mfg: Murata Electronics; Current: *; CreatedBy: Jonathan Bouchard; Power: *; Precision: 20%
C122 = CAP - 0805: 4.7 µF ±10% 50V Ceramic Capacitor X5R 0805 (2012 Metric); Mfg Part Number: GRT21BR61H475KE13L; Mfg: Murata Electronics; Current: *; CreatedBy: Jonathan Bouchard; Power: *; Precision: 10%
C123 C124 = CAP - 0603: Mfg Part Number: C0603X474K8RAC; Precision: 10%; Current: *; CreatedBy: Jonathan Bouchard; Power: *
D1 = TVS_USB_TPD2E001DRLR: TVS - USB TVS DIODE 5.5V - SOT-553; Manufacturer #1: Texas Instruments; Value: 11V Breakdown; Voltage Rating: 5.5V (Max); GRAMS Lib Spec: 2.8; Magnetic Material: YES; Cryo: UNKNOWN; Tolerance: *; Current Rating: *; Power Max: *; HelpURL: http://www.ti.com/lit/ds/symlink/tpd2e001.pdf; CreatedBy/Date: Jonathan Bouchard 2018-07-10; VerifiedBy: Arnaud Samson 16-07-18; Temperature: -40°C ~ 85°C (TA); Package: SOT-553; Manufacturer #2: *; Part Number #2: *; Part Number #1: TPD2E001DRLR; Polarized: YES; Supplier 1: Digi-Key; Supplier Part Number 1: 296-21883-1-ND; Mfg Part Number: TPD2E001DRLR
ISO1 = ISO_ADUM3160BRWZ-RL: ISO - DGTL ISO 2.5KV 2CH USB - 16SOIC; Manufacturer #1: Analog Devices; Value: 2500Vrms voltage isolation; Voltage Rating: 3~5.5V; GRAMS Lib Spec: 2.8; Magnetic Material: UNKNOWN; Polarized: Yes; Tolerance: *; Current Rating: *; Power Max: *; HelpURL: https://www.analog.com/media/en/technical-documentation/data-sheets/ADuM3160.pdf; CreatedBy/Date: Tommy Rossignol 2018-11-16; VerifiedBy: Caroline Paulin - 13 février 2019; Temperature: -40°C ~ 105°C; Package: 16-SOIC; Manufacturer #2: *; Part Number #2: *; Part Number #1: ADUM3160BRWZ-RL; Supplier 1: Digi-Key; Supplier Part Number 1: ADUM3160BRWZ-RLCT-ND; Cryo: UNKNOWN; Mfg Part Number: ADUM3160BRWZ-RL
J1 = CON_USB_10118194-0001LF: CON - USB MICRO B RECPT SMT R/A - 4PIN; Manufacturer #1: Amphenol FCI; Value: USB - Micro B; Voltage Rating: 100VAC; Current Rating: 1.8A; GRAMS Lib Spec: 2.8; Magnetic Material: YES; Cryo: UNKNOWN; Tolerance: *; Power Max: *; HelpURL: https://cdn.amphenol-icc.com/media/wysiwyg/files/drawing/10118194.pdf; CreatedBy/Date: Arnaud Samson - 09/07/18; VerifiedBy: Jonathan Bouchard 2018-07-12; Temperature: -30°C ~ 80°C; Package: 5-SMD; Manufacturer #2: *; Part Number #2: *; Part Number #1: 10118194-0001LF; Polarized: YES; Supplier 1: Digi-Key; Supplier Part Number 1: 609-4618-1-ND; Mfg Part Number: 10118194-0001LF
M1 = MOD_JTAG_410-357-B: MOD - JTAG-SMT3-NC Programming Module For Xilinx FPGA - 18-SMT; Manufacturer #1: Digilent; Voltage Rating: VDD: 2.97V~3.63V, VJTAG/VUART: 1.65V~5.5V; GRAMS Lib Spec: 2.8; Magnetic Material: Unknown; Polarized: Yes; Value: *; Tolerance: *; Current Rating: *; Power Max: *; HelpURL: https://reference.digilentinc.com/_media/reference/programmers/jtag-smt3/jtag-smt3-nc_rm.pdf; CreatedBy/Date: Tommy Rossignol 2018-11-23; VerifiedBy: Nicolas V. (2019-01-28); Temperature: -40°C ~ 85°C; Package: 18-pad SMT; Manufacturer #2: *; Part Number #2: *; Part Number #1: 410-357-B; Supplier 1: Digi-Key; Supplier Part Number 1: 1286-1196-ND; Cryo: UNKNOWN; Mfg Part Number: 410-357-B
R33 = RES - 0402: 20 Ohms ±1% 0.063W, 1/16W Chip Resistor 0402 (1005 Metric) Moisture Resistant Thick Film; Mfg Part Number: RC0402FR-0720RL; Voltage: 75V; Current: *; CreatedBy: Jonathan Bouchard; Power: 1/16W; Part Number #1: RC0402FR-0720RL
R34 R35 = RES - 0402: 100 Ohms ±1% 0.1W, 1/10W Chip Resistor 0402 (1005 Metric) Automotive AEC-Q200 Thick Film; Mfg Part Number: RK73H1ETTP1000F; Voltage: 75V; Current: *; CreatedBy: Jonathan Bouchard; Power: 1/10W; Part Number #1: RK73H1ETTP1000F
R36 R37 R40 = RES - 0402: 4.7 kOhms ±1% 0.063W, 1/16W Chip Resistor 0402 (1005 Metric) Moisture Resistant Thick Film; Mfg Part Number: RC0402FR-074K7L; Voltage: 50V; Current: *; CreatedBy: Jonathan Bouchard; Power: 1/16W; Part Number #1: RC0402FR-074K7L
R38 = RES - 0402: 330 Ohms ±1% 0.063W, 1/16W Chip Resistor 0402 (1005 Metric) Moisture Resistant Thick Film; Mfg Part Number: RC0402FR-07330RL; Voltage: 50V; Current: *; CreatedBy: Jonathan Bouchard; Power: 1/16W; Part Number #1: RC0402FR-07330RL
R39 = RES - 0402: 2.4 kOhms ±5% 0.063W, 1/16W Chip Resistor 0402 (1005 Metric) Moisture Resistant Thick Film; Mfg Part Number: RC0402JR-072K4L; Voltage: 50V; Current: *; CreatedBy: Jonathan Bouchard; Power: 1/16W; Part Number #1: RC0402JR-072K4L
R41 R58 = RES - 0402: 10 kOhms ±1% 0.063W, 1/16W Chip Resistor 0402 (1005 Metric) Automotive AEC-Q200 Thick Film; Mfg Part Number: RMCF0402FT10K0; Voltage: 75V; Current: *; CreatedBy: Jonathan Bouchard; Power: 1/16W; Part Number #1: RMCF0402FT10K0
R42-R45 = RES - 0402: 24 Ohms ±1% 0.063W, 1/16W Chip Resistor 0402 (1005 Metric) Moisture Resistant Thick Film; Mfg Part Number: RC0402FR-0724RL; Voltage: 50V; Current: *; CreatedBy: Jonathan Bouchard; Power: 1/16W; Part Number #1: RC0402FR-0724RL
R46 = RES - 0603: 0 Ohms Jumper Chip Resistor 0603 (1608 Metric) Automotive AEC-Q200 Thick Film; Mfg Part Number: ERJ-3GEY0R00V; Voltage: 75V; Mfg: Panasonic Electronic Components; Current: *; CreatedBy: Jonathan Bouchard; Part Number #1: ERJ-3GEY0R00V
U1 = FPGA_XC6SLX100-3FGG676C: FPGA - XILINX SPARTAN 6 480 I/O - BGA-676; Voltage: 1.14 V ~ 1.26 V; Current: *; Power: *; Mfg: Xilinx; Mfg Part Number: XC6SLX100-3FGG676C; HelpURL: https://www.xilinx.com/support/documentation/data_sheets/ds162.pdf; CreatedBy: Jonathan Bouchard; Temperature: 0°C ~ 85°C (TJ); Value: *; Precision: *; Package: BGA-676; Supplier 1: Digikey; Supplier Part Number 1: 122-1760-ND; Part Number #1: XC6SLX100-3FGG676C
U4 = CMP-0677-00004-1: Low-Voltage, Serial Flash Memory with SPI Bus Interface, 128 Mbit, 54 MHz, 2.7 to 3.6 V, 8-Pin VDFPN (MLP), RoHS, Tape and Reel; Supply Voltage Min: 2.7 V; Supply Voltage Max: 3.6 V; Memory Size: 128 Mbits; Temperature Max: 85 degC; PackageDescription: 8-Pin Very Thin Dual Flat Package No lead, Body 8 x 6 mm, Pitch 1.27 mm; Generic Part Number: M25P128; DatasheetVersion: Rev. 6; Packing: Tape and Reel; RoHS: TRUE; PartNumber: M25P128-VME6TGB; Temperature Min: -40 degC; Mfg Part Number: M25P128-VME6TGB; Part Number #1: M25P128-VME6TGB
U6 = ISO_SI8620BB-B-IS: ISO - Dual-Channel Digital Isolator (default Low) - 8-SOIC; Manufacturer #1: Silicon Labs; Voltage Rating: 2.5-5.5V; GRAMS Lib Spec: 2.8; Magnetic Material: Unknown; Polarized: Yes; Value: *; Tolerance: *; Current Rating: *; Power Max: *; HelpURL: https://www.silabs.com/documents/public/data-sheets/si861x-2x-datasheet.pdf; CreatedBy/Date: Joel Lemay 2018-06-05; VerifiedBy: Caroline Paulin - 12 sept 2018; Temperature: -40°C ~ 125°C; Package: 8-SOIC; Manufacturer #2: *; Part Number #2: *; Part Number #1: SI8620BB-B-IS; Supplier 1: Digi-Key; Supplier Part Number 1: 336-2567-ND; Cryo: UNKNOWN; Mfg Part Number: SI8620BB-B-IS

## Sheet S7CAS-PLEIADES-CARTE-MERE_P01_FPGA-BANK3.SchDoc
size Tabloid; DocumentNumber: 14; SheetNumber: 14; SheetTotal: 17; Sheet_Name: FPGA - BANK 3; Size: 11x17
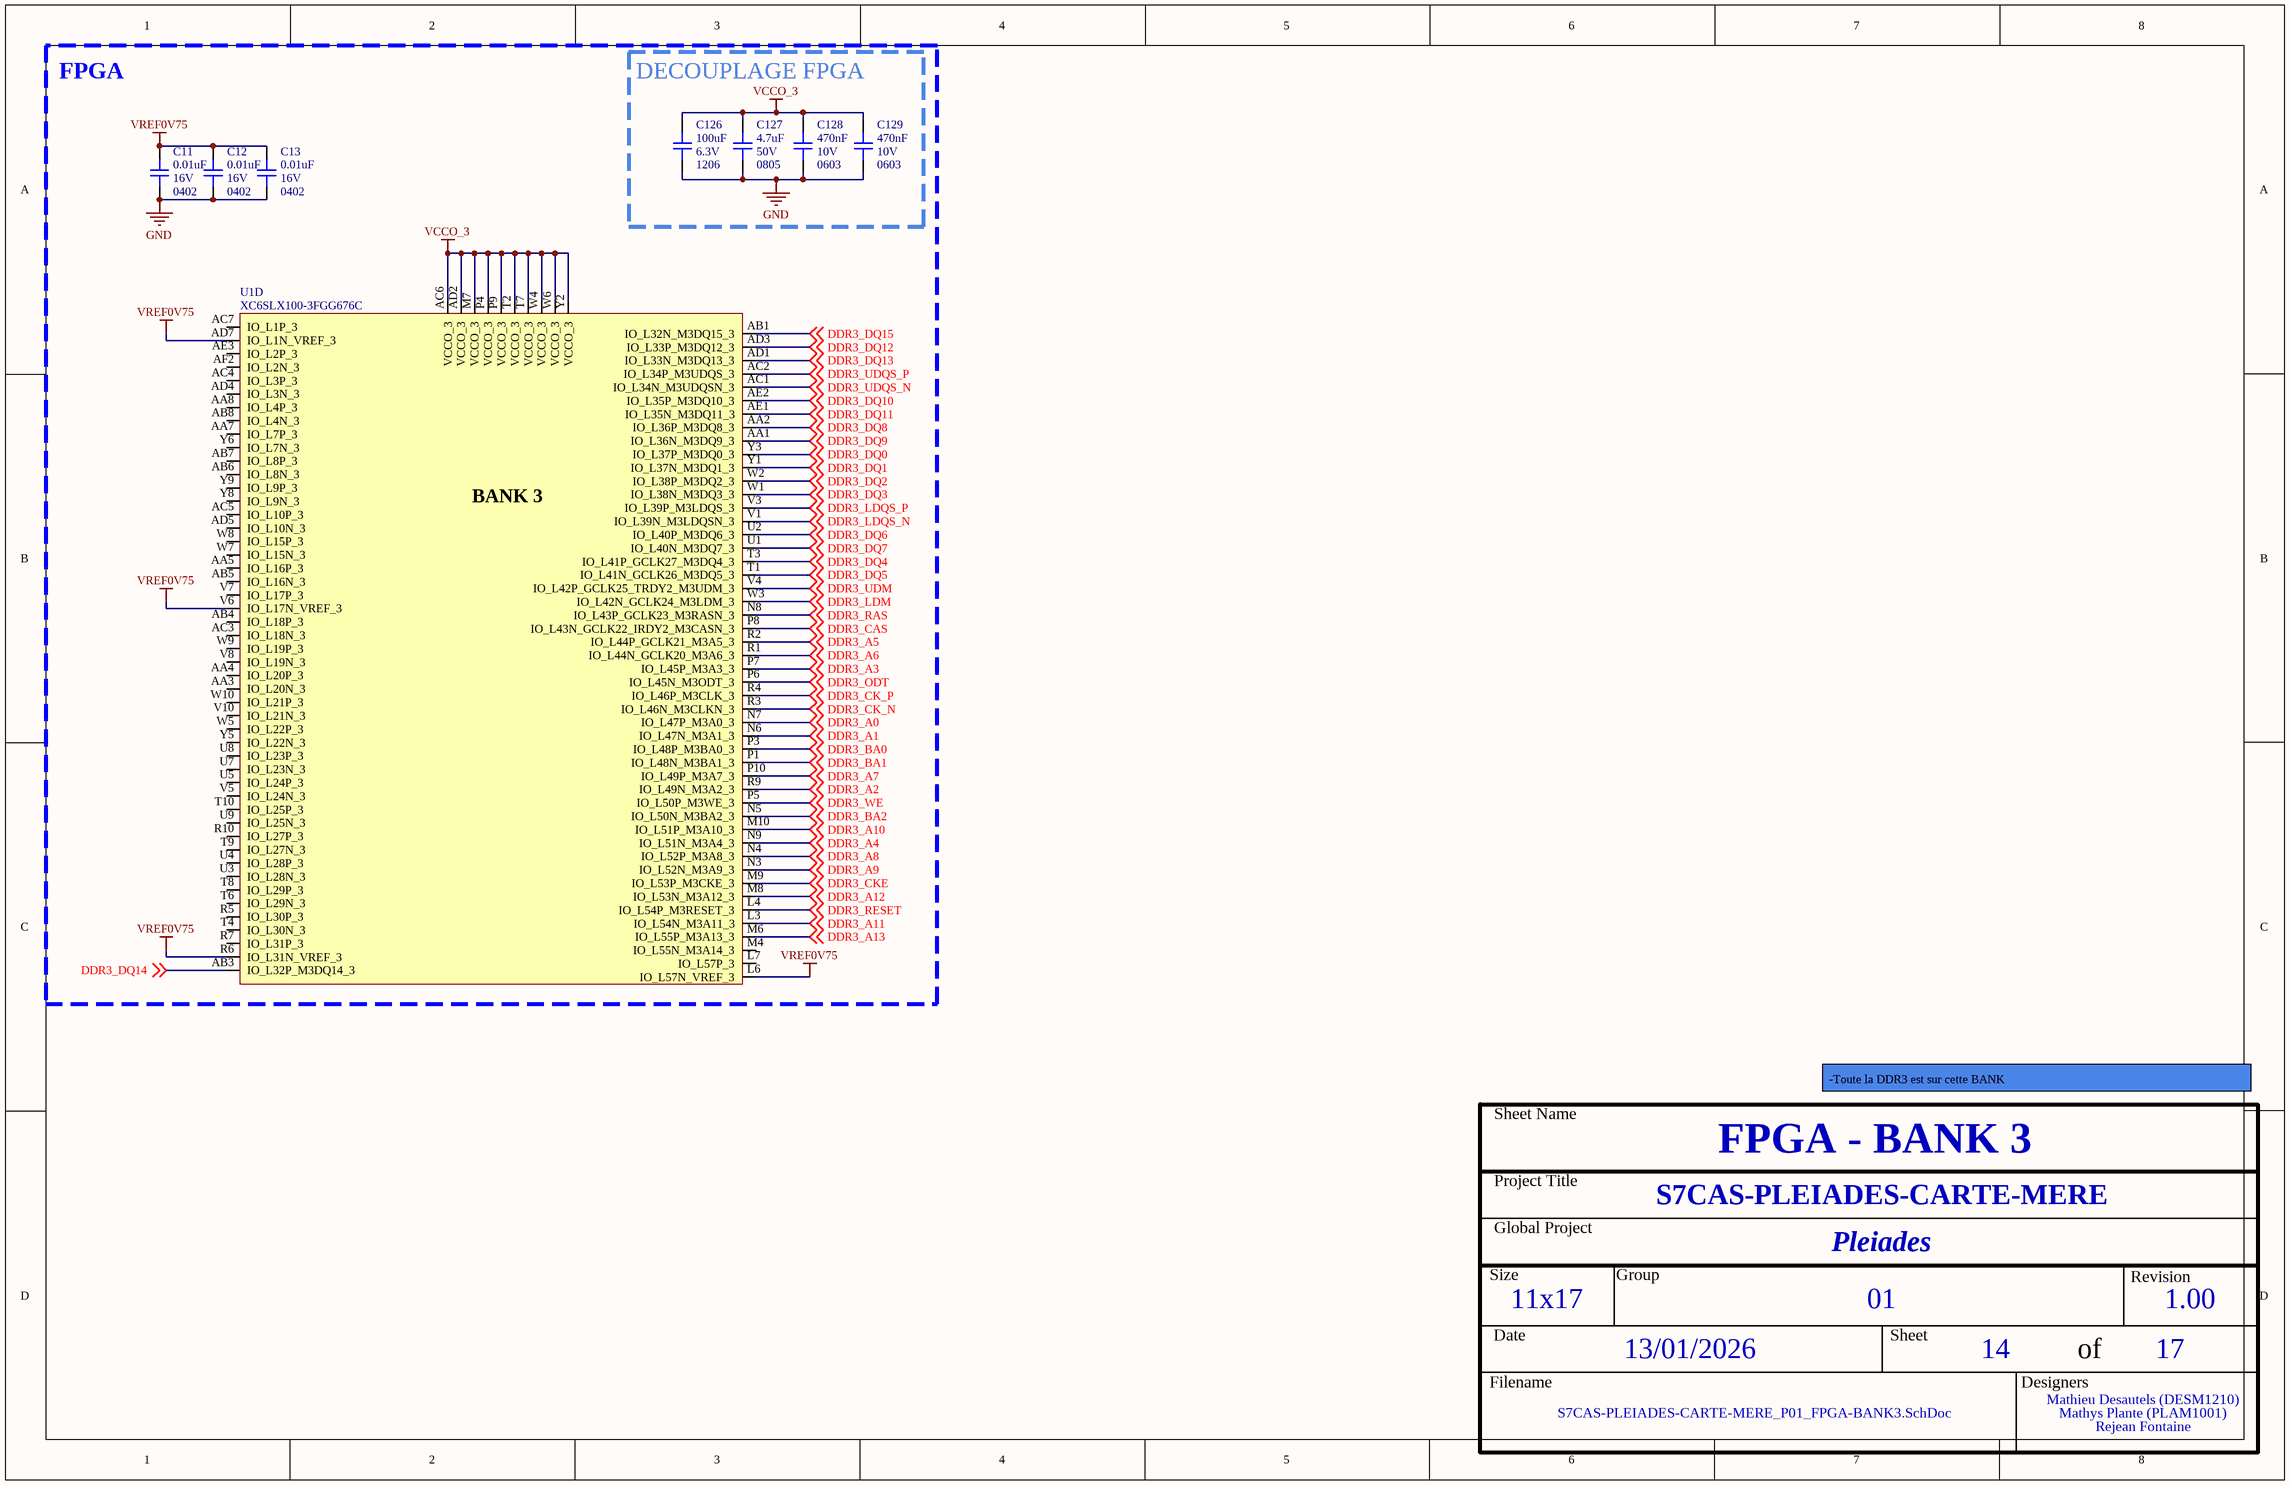
[diagram p13: S7CAS-PLEIADES-CARTE-MERE_P01_FPGA-BANK3.SchDoc]

### Parts
C11  value 0.01uF  Voltage: 16V  Package: 0402  [CAP_0402]  (hidden comment: CAP - 0402)
C12  value 0.01uF  Voltage: 16V  Package: 0402  [CAP_0402]  (hidden comment: CAP - 0402)
C13  value 0.01uF  Voltage: 16V  Package: 0402  [CAP_0402]  (hidden comment: CAP - 0402)
C126  value 100uF  Voltage: 6.3V  Package: 1206  [CAP_1206]  (hidden comment: CAP - 1206)
C127  value 4.7uF  Voltage: 50V  Package: 0805  [CAP_0805]  (hidden comment: CAP - 0805)
C128  value 470nF  Voltage: 10V  Package: 0603  [CAP_0603]  (hidden comment: CAP - 0603)
C129  value 470nF  Voltage: 10V  Package: 0603  [CAP_0603]  (hidden comment: CAP - 0603)
U1  XC6SLX100-3FGG676C  [FPGA_XILINX_FGG676]  (part D of 10)

### Blocks framed on the sheet
FPGA: C11-C13 U1
DECOUPLAGE FPGA: C126-C129

### Nets
GND: C11.1 C12.1 C13.1 C126.1 C127.1 C128.1 C129.1
VCCO_3: C126.2 C127.2 C128.2 C129.2 U1.AC6(VCCO_3) U1.AD2(VCCO_3) U1.M7(VCCO_3) U1.P4(VCCO_3) U1.P9(VCCO_3) U1.T2(VCCO_3) U1.T7(VCCO_3) U1.W4(VCCO_3) U1.W6(VCCO_3) U1.Y2(VCCO_3)  [project net VCC1V5]
VREF0V75: C11.2 C12.2 C13.2 U1.AD7(IO_L1N_VREF_3) U1.L6(IO_L57N_VREF_3) U1.R6(IO_L31N_VREF_3) U1.V6(IO_L17N_VREF_3)
DDR3_A0: U1.N7(IO_L47P_M3A0_3) ; off-sheet DDR3_A0
DDR3_A1: U1.N6(IO_L47N_M3A1_3) ; off-sheet DDR3_A1
DDR3_A2: U1.R9(IO_L49N_M3A2_3) ; off-sheet DDR3_A2
DDR3_A3: U1.P7(IO_L45P_M3A3_3) ; off-sheet DDR3_A3
DDR3_A4: U1.N9(IO_L51N_M3A4_3) ; off-sheet DDR3_A4
DDR3_A5: U1.R2(IO_L44P_GCLK21_M3A5_3) ; off-sheet DDR3_A5
DDR3_A6: U1.R1(IO_L44N_GCLK20_M3A6_3) ; off-sheet DDR3_A6
DDR3_A7: U1.P10(IO_L49P_M3A7_3) ; off-sheet DDR3_A7
DDR3_A8: U1.N4(IO_L52P_M3A8_3) ; off-sheet DDR3_A8
DDR3_A9: U1.N3(IO_L52N_M3A9_3) ; off-sheet DDR3_A9
DDR3_A10: U1.M10(IO_L51P_M3A10_3) ; off-sheet DDR3_A10
DDR3_A11: U1.L3(IO_L54N_M3A11_3) ; off-sheet DDR3_A11
DDR3_A12: U1.M8(IO_L53N_M3A12_3) ; off-sheet DDR3_A12
DDR3_A13: U1.M6(IO_L55P_M3A13_3) ; off-sheet DDR3_A13
DDR3_BA0: U1.P3(IO_L48P_M3BA0_3) ; off-sheet DDR3_BA0
DDR3_BA1: U1.P1(IO_L48N_M3BA1_3) ; off-sheet DDR3_BA1
DDR3_BA2: U1.N5(IO_L50N_M3BA2_3) ; off-sheet DDR3_BA2
DDR3_CAS: U1.P8(IO_L43N_GCLK22_IRDY2_M3CASN_3) ; off-sheet DDR3_CAS
DDR3_CK_N: U1.R3(IO_L46N_M3CLKN_3) ; off-sheet DDR3_CK_N
DDR3_CK_P: U1.R4(IO_L46P_M3CLK_3) ; off-sheet DDR3_CK_P
DDR3_CKE: U1.M9(IO_L53P_M3CKE_3) ; off-sheet DDR3_CKE
DDR3_DQ0: U1.Y3(IO_L37P_M3DQ0_3) ; off-sheet DDR3_DQ0
DDR3_DQ1: U1.Y1(IO_L37N_M3DQ1_3) ; off-sheet DDR3_DQ1
DDR3_DQ2: U1.W2(IO_L38P_M3DQ2_3) ; off-sheet DDR3_DQ2
DDR3_DQ3: U1.W1(IO_L38N_M3DQ3_3) ; off-sheet DDR3_DQ3
DDR3_DQ4: U1.T3(IO_L41P_GCLK27_M3DQ4_3) ; off-sheet DDR3_DQ4
DDR3_DQ5: U1.T1(IO_L41N_GCLK26_M3DQ5_3) ; off-sheet DDR3_DQ5
DDR3_DQ6: U1.U2(IO_L40P_M3DQ6_3) ; off-sheet DDR3_DQ6
DDR3_DQ7: U1.U1(IO_L40N_M3DQ7_3) ; off-sheet DDR3_DQ7
DDR3_DQ8: U1.AA2(IO_L36P_M3DQ8_3) ; off-sheet DDR3_DQ8
DDR3_DQ9: U1.AA1(IO_L36N_M3DQ9_3) ; off-sheet DDR3_DQ9
DDR3_DQ10: U1.AE2(IO_L35P_M3DQ10_3) ; off-sheet DDR3_DQ10
DDR3_DQ11: U1.AE1(IO_L35N_M3DQ11_3) ; off-sheet DDR3_DQ11
DDR3_DQ12: U1.AD3(IO_L33P_M3DQ12_3) ; off-sheet DDR3_DQ12
DDR3_DQ13: U1.AD1(IO_L33N_M3DQ13_3) ; off-sheet DDR3_DQ13
DDR3_DQ14: U1.AB3(IO_L32P_M3DQ14_3) ; off-sheet DDR3_DQ14
DDR3_DQ15: U1.AB1(IO_L32N_M3DQ15_3) ; off-sheet DDR3_DQ15
DDR3_LDM: U1.W3(IO_L42N_GCLK24_M3LDM_3) ; off-sheet DDR3_LDM
DDR3_LDQS_N: U1.V1(IO_L39N_M3LDQSN_3) ; off-sheet DDR3_LDQS_N
DDR3_LDQS_P: U1.V3(IO_L39P_M3LDQS_3) ; off-sheet DDR3_LDQS_P
DDR3_ODT: U1.P6(IO_L45N_M3ODT_3) ; off-sheet DDR3_ODT
DDR3_RAS: U1.N8(IO_L43P_GCLK23_M3RASN_3) ; off-sheet DDR3_RAS
DDR3_RESET: U1.L4(IO_L54P_M3RESET_3) ; off-sheet DDR3_RESET
DDR3_UDM: U1.V4(IO_L42P_GCLK25_TRDY2_M3UDM_3) ; off-sheet DDR3_UDM
DDR3_UDQS_N: U1.AC1(IO_L34N_M3UDQSN_3) ; off-sheet DDR3_UDQS_N
DDR3_UDQS_P: U1.AC2(IO_L34P_M3UDQS_3) ; off-sheet DDR3_UDQS_P
DDR3_WE: U1.P5(IO_L50P_M3WE_3) ; off-sheet DDR3_WE

Not connected (* = marked no-connect by the designer): U1 AA3(IO_L20N_3) AA4(IO_L20P_3) AA5(IO_L16P_3) AA7(IO_L7P_3) AA8(IO_L4P_3) AB4(IO_L18P_3) AB5(IO_L16N_3) AB6(IO_L8N_3) AB7(IO_L8P_3) AB8(IO_L4N_3) AC3(IO_L18N_3) AC4(IO_L3P_3) AC5(IO_L10P_3) AC7(IO_L1P_3) AD4(IO_L3N_3) AD5(IO_L10N_3) AE3(IO_L2P_3) AF2(IO_L2N_3) L7(IO_L57P_3) M4(IO_L55N_M3A14_3) R5(IO_L30P_3) R7(IO_L31P_3) R10(IO_L27P_3) T4(IO_L30N_3) T6(IO_L29N_3) T8(IO_L29P_3) T9(IO_L27N_3) T10(IO_L25P_3) U3(IO_L28N_3) U4(IO_L28P_3) U5(IO_L24P_3) U7(IO_L23N_3) U8(IO_L23P_3) U9(IO_L25N_3) V5(IO_L24N_3) V7(IO_L17P_3) V8(IO_L19N_3) V10(IO_L21N_3) W5(IO_L22P_3) W7(IO_L15N_3) W8(IO_L15P_3) W9(IO_L19P_3) W10(IO_L21P_3) Y5(IO_L22N_3) Y6(IO_L7N_3) Y8(IO_L9N_3) Y9(IO_L9P_3)

### Notes on the sheet
- -Toute la DDR3 est sur cette BANK
- Sheet Name
- Project Title
- Global Project
- Size
- Group
- Revision
- Date
- Sheet
- of
- Filename
- Designers
- (in symbol FPGA_XC6SLX100-3FGG676C, part D) BANK 3

### Library data of the parts
C11-C13 = CAP - 0402: 10000 pF ±10% 16V Ceramic Capacitor X7R 0402 (1005 Metric); Part Number #1: C0402C103K4RACTU; Mfg: KEMET; Current: *; CreatedBy: Jonathan Bouchard; Power: *; Precision: 10%; Mfg Part Number: C0402C103K4RACTU
C126 = CAP - 1206: as C121 on sheet S7CAS-PLEIADES-CARTE-MERE_P01_FPGA-BANK2; Current: *; CreatedBy: Jonathan Bouchard; Power: *; Precision: 20%
C127 = CAP - 0805: as C122 on sheet S7CAS-PLEIADES-CARTE-MERE_P01_FPGA-BANK2; Current: *; CreatedBy: Jonathan Bouchard; Power: *; Precision: 10%
C128 C129 = CAP - 0603: as C123 on sheet S7CAS-PLEIADES-CARTE-MERE_P01_FPGA-BANK2; Current: *; CreatedBy: Jonathan Bouchard; Power: *
U1 = FPGA_XC6SLX100-3FGG676C: as U1 on sheet S7CAS-PLEIADES-CARTE-MERE_P01_FPGA-BANK2; Current: *; Power: *; Mfg: Xilinx; Mfg Part Number: XC6SLX100-3FGG676C; HelpURL: https://www.xilinx.com/support/documentation/data_sheets/ds162.pdf; CreatedBy: Jonathan Bouchard; Temperature: 0°C ~ 85°C (TJ); Value: *; Precision: *; Package: BGA-676; Supplier 1: Digikey; Supplier Part Number 1: 122-1760-ND; Part Number #1: XC6SLX100-3FGG676C

## Sheet S7CAS-PLEIADES-CARTE-MERE_P01_FPGA-BANK4.SchDoc
size Tabloid; DocumentNumber: 15; SheetNumber: 15; SheetTotal: 17; Sheet_Name: FPGA - BANK 4; Size: 11x17
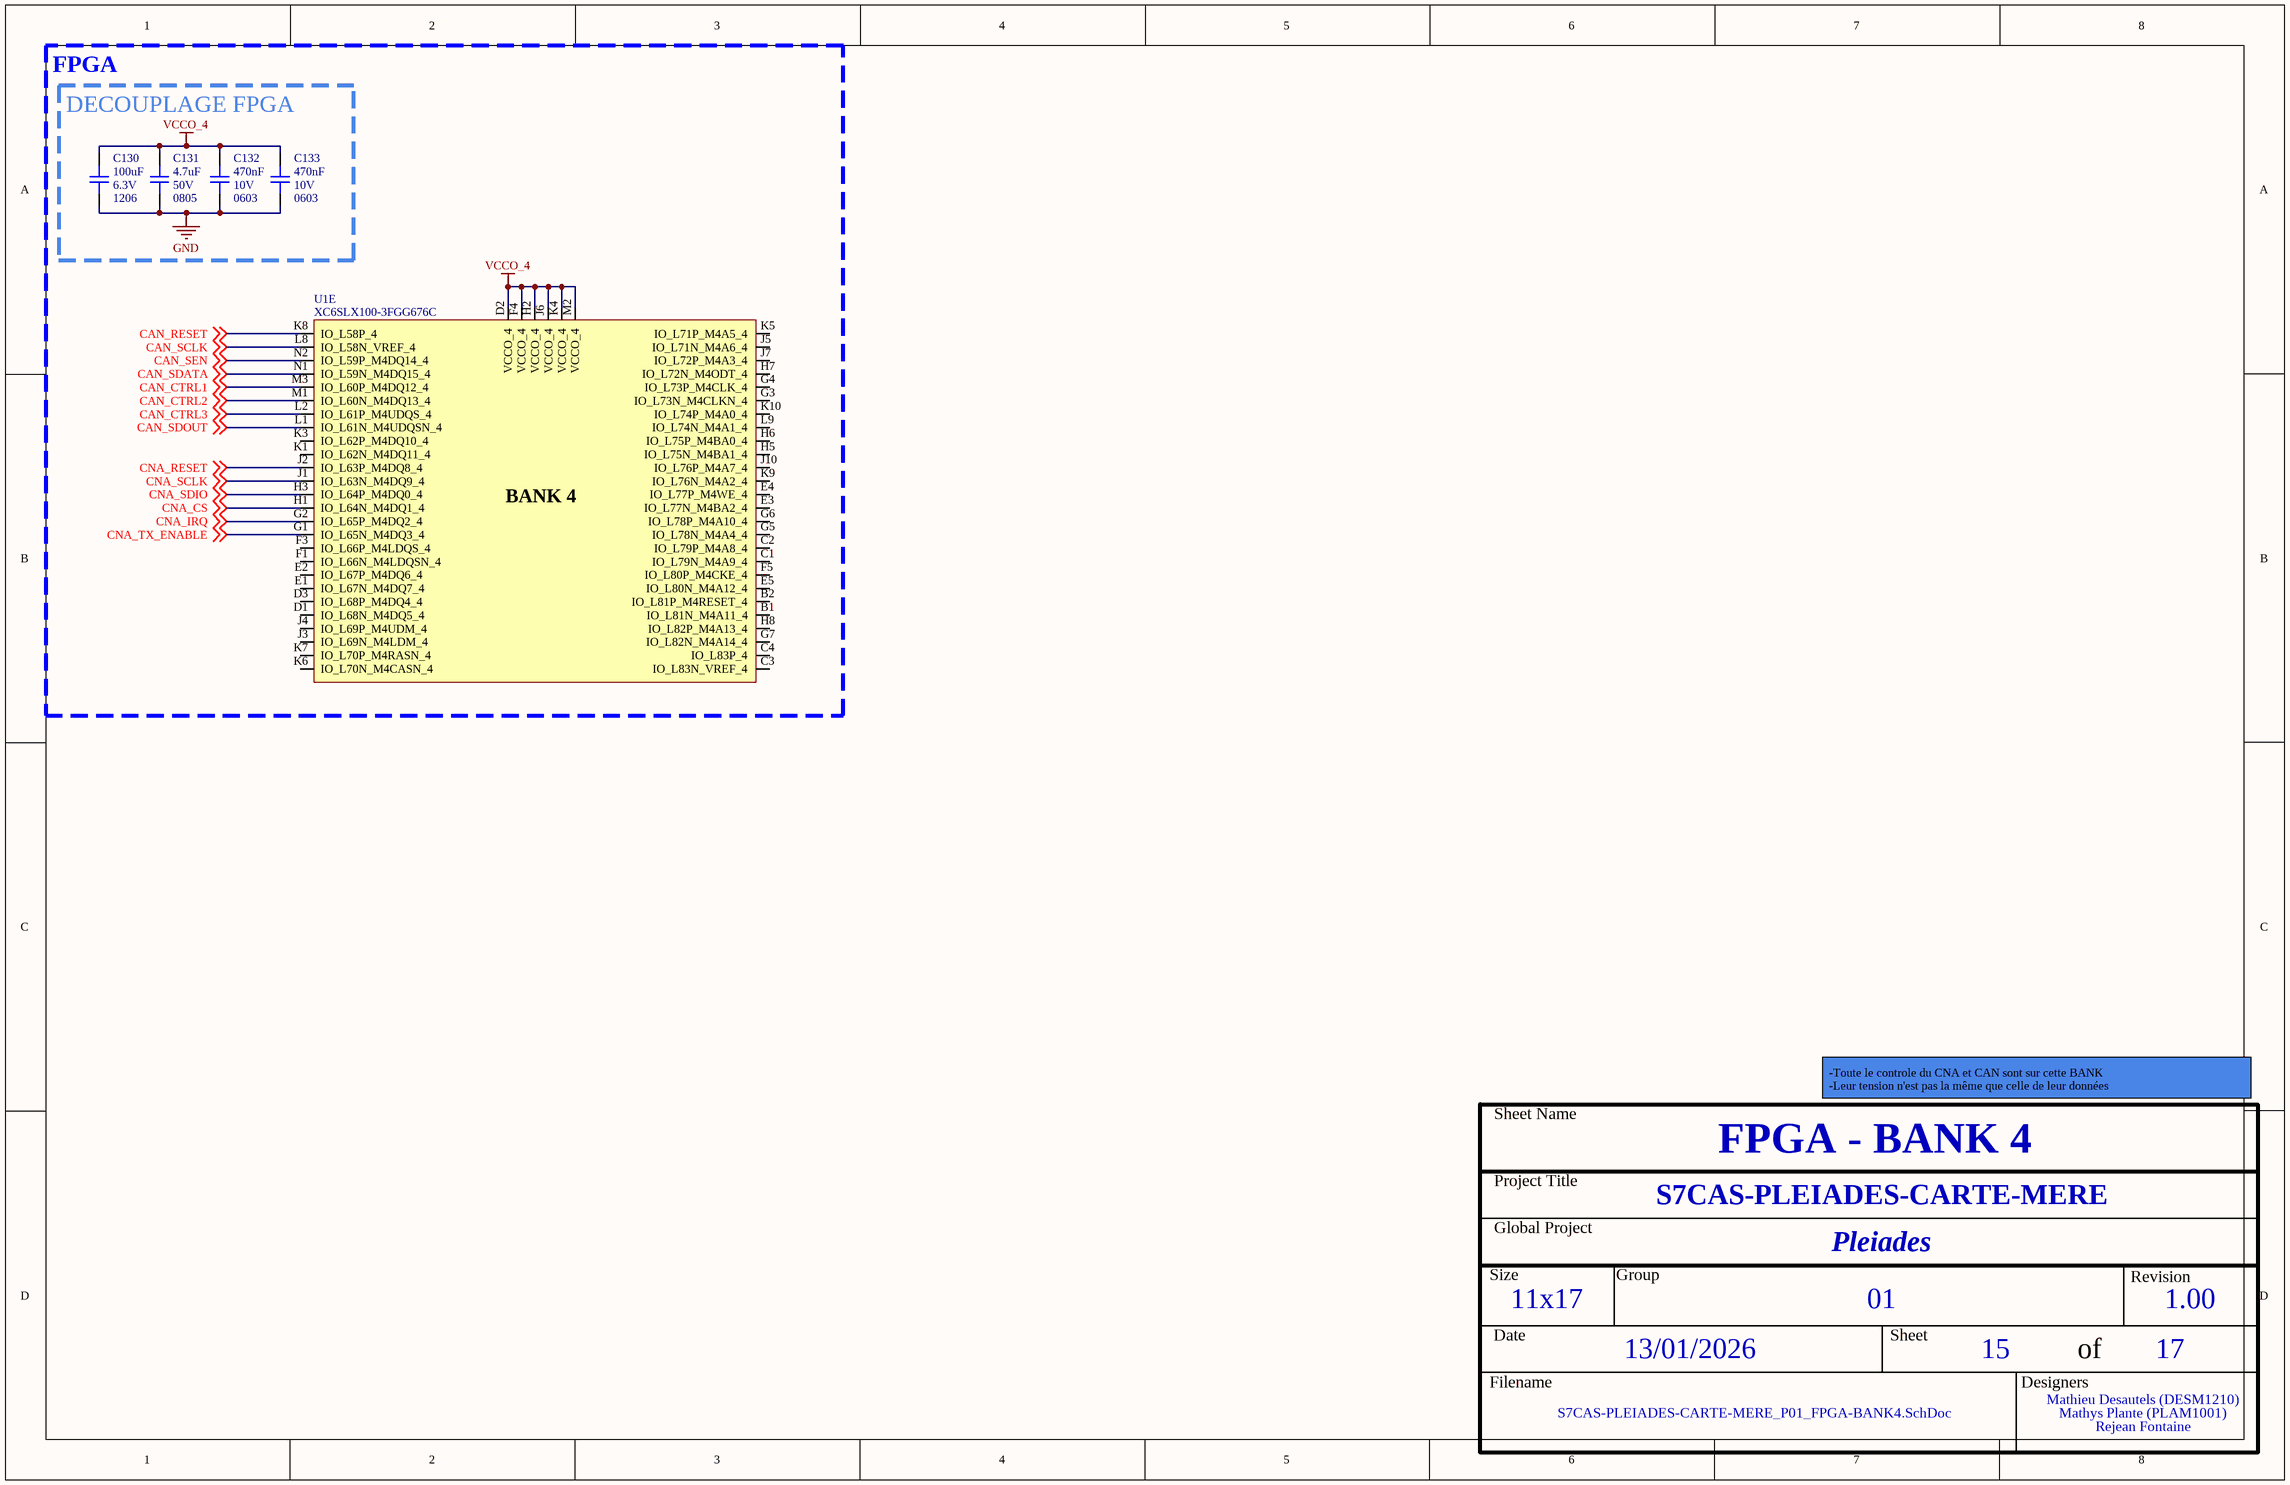
[diagram p14: S7CAS-PLEIADES-CARTE-MERE_P01_FPGA-BANK4.SchDoc]

### Parts
C130  value 100uF  Voltage: 6.3V  Package: 1206  [CAP_1206]  (hidden comment: CAP - 1206)
C131  value 4.7uF  Voltage: 50V  Package: 0805  [CAP_0805]  (hidden comment: CAP - 0805)
C132  value 470nF  Voltage: 10V  Package: 0603  [CAP_0603]  (hidden comment: CAP - 0603)
C133  value 470nF  Voltage: 10V  Package: 0603  [CAP_0603]  (hidden comment: CAP - 0603)
U1  XC6SLX100-3FGG676C  [FPGA_XILINX_FGG676]  (part E of 10)

### Blocks framed on the sheet
FPGA: U1
DECOUPLAGE FPGA: C130-C133

### Nets
GND: C130.1 C131.1 C132.1 C133.1
VCCO_4: C130.2 C131.2 C132.2 C133.2 U1.D2(VCCO_4) U1.F4(VCCO_4) U1.H2(VCCO_4) U1.J6(VCCO_4) U1.K4(VCCO_4) U1.M2(VCCO_4)  [project net CLK_1V8]
CAN_CTRL1: U1.M3(IO_L60P_M4DQ12_4) ; off-sheet CAN_CTRL1
CAN_CTRL2: U1.M1(IO_L60N_M4DQ13_4) ; off-sheet CAN_CTRL2
CAN_CTRL3: U1.L2(IO_L61P_M4UDQS_4) ; off-sheet CAN_CTRL3
CAN_RESET: U1.K8(IO_L58P_4) ; off-sheet CAN_RESET
CAN_SCLK: U1.L8(IO_L58N_VREF_4) ; off-sheet CAN_SCLK
CAN_SDATA: U1.N1(IO_L59N_M4DQ15_4) ; off-sheet CAN_SDATA
CAN_SDOUT: U1.L1(IO_L61N_M4UDQSN_4) ; off-sheet CAN_SDOUT
CAN_SEN: U1.N2(IO_L59P_M4DQ14_4) ; off-sheet CAN_SEN
CNA_CS: U1.H1(IO_L64N_M4DQ1_4) ; off-sheet CNA_CS
CNA_IRQ: U1.G2(IO_L65P_M4DQ2_4) ; off-sheet CNA_IRQ
CNA_RESET: U1.J2(IO_L63P_M4DQ8_4) ; off-sheet CNA_RESET
CNA_SCLK: U1.J1(IO_L63N_M4DQ9_4) ; off-sheet CNA_SCLK
CNA_SDIO: U1.H3(IO_L64P_M4DQ0_4) ; off-sheet CNA_SDIO
CNA_TX_ENABLE: U1.G1(IO_L65N_M4DQ3_4) ; off-sheet CNA_TX_ENABLE

Not connected (* = marked no-connect by the designer): U1 B1(IO_L81N_M4A11_4) B2(IO_L81P_M4RESET_4) C1(IO_L79N_M4A9_4) C2(IO_L79P_M4A8_4) C3(IO_L83N_VREF_4) C4(IO_L83P_4) D1(IO_L68N_M4DQ5_4) D3(IO_L68P_M4DQ4_4) E1(IO_L67N_M4DQ7_4) E2(IO_L67P_M4DQ6_4) E3(IO_L77N_M4BA2_4) E4(IO_L77P_M4WE_4) E5(IO_L80N_M4A12_4) F1(IO_L66N_M4LDQSN_4) F3(IO_L66P_M4LDQS_4) F5(IO_L80P_M4CKE_4) G3(IO_L73N_M4CLKN_4) G4(IO_L73P_M4CLK_4) G5(IO_L78N_M4A4_4) G6(IO_L78P_M4A10_4) G7(IO_L82N_M4A14_4) H5(IO_L75N_M4BA1_4) H6(IO_L75P_M4BA0_4) H7(IO_L72N_M4ODT_4) H8(IO_L82P_M4A13_4) J3(IO_L69N_M4LDM_4) J4(IO_L69P_M4UDM_4) J5(IO_L71N_M4A6_4) J7(IO_L72P_M4A3_4) J10(IO_L76P_M4A7_4) K1(IO_L62N_M4DQ11_4) K3(IO_L62P_M4DQ10_4) K5(IO_L71P_M4A5_4) K6(IO_L70N_M4CASN_4) K7(IO_L70P_M4RASN_4) K9(IO_L76N_M4A2_4) K10(IO_L74P_M4A0_4) L9(IO_L74N_M4A1_4)

### Notes on the sheet
- -Toute le controle du CNA et CAN sont sur cette BANK
  -Leur tension n'est pas la même que celle de leur données
- Sheet Name
- Project Title
- Global Project
- Size
- Group
- Revision
- Date
- Sheet
- of
- Filename
- Designers
- (in symbol FPGA_XC6SLX100-3FGG676C, part E) BANK 4

### Library data of the parts
C130 = CAP - 1206: as C121 on sheet S7CAS-PLEIADES-CARTE-MERE_P01_FPGA-BANK2; Current: *; CreatedBy: Jonathan Bouchard; Power: *; Precision: 20%
C131 = CAP - 0805: as C122 on sheet S7CAS-PLEIADES-CARTE-MERE_P01_FPGA-BANK2; Current: *; CreatedBy: Jonathan Bouchard; Power: *; Precision: 10%
C132 C133 = CAP - 0603: as C123 on sheet S7CAS-PLEIADES-CARTE-MERE_P01_FPGA-BANK2; Current: *; CreatedBy: Jonathan Bouchard; Power: *
U1 = FPGA_XC6SLX100-3FGG676C: as U1 on sheet S7CAS-PLEIADES-CARTE-MERE_P01_FPGA-BANK2; Current: *; Power: *; Mfg: Xilinx; Mfg Part Number: XC6SLX100-3FGG676C; HelpURL: https://www.xilinx.com/support/documentation/data_sheets/ds162.pdf; CreatedBy: Jonathan Bouchard; Temperature: 0°C ~ 85°C (TJ); Value: *; Precision: *; Package: BGA-676; Supplier 1: Digikey; Supplier Part Number 1: 122-1760-ND; Part Number #1: XC6SLX100-3FGG676C

## Sheet S7CAS-PLEIADES-CARTE-MERE_P01_FPGA-BANK5.SchDoc
size Tabloid; DocumentNumber: 16; SheetNumber: 16; SheetTotal: 17; Sheet_Name: FPGA - BANK 5; Size: 11x17
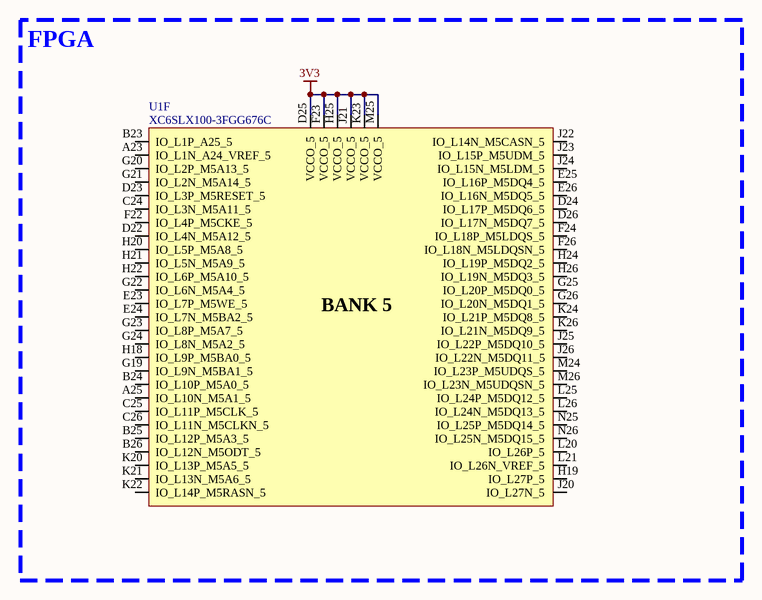
[diagram p15: S7CAS-PLEIADES-CARTE-MERE_P01_FPGA-BANK5.SchDoc]

### Parts
U1  XC6SLX100-3FGG676C  [FPGA_XILINX_FGG676]  (part F of 10)

### Blocks framed on the sheet
FPGA: U1

### Nets
3V3: U1.D25(VCCO_5) U1.F23(VCCO_5) U1.H25(VCCO_5) U1.J21(VCCO_5) U1.K23(VCCO_5) U1.M25(VCCO_5)  [project net VDD_3V3]

Not connected (* = marked no-connect by the designer): U1 A23(IO_L1N_A24_VREF_5) A25(IO_L10N_M5A1_5) B23(IO_L1P_A25_5) B24(IO_L10P_M5A0_5) B25(IO_L12P_M5A3_5) B26(IO_L12N_M5ODT_5) C24(IO_L3N_M5A11_5) C25(IO_L11P_M5CLK_5) C26(IO_L11N_M5CLKN_5) D22(IO_L4N_M5A12_5) D23(IO_L3P_M5RESET_5) D24(IO_L17P_M5DQ6_5) D26(IO_L17N_M5DQ7_5) E23(IO_L7P_M5WE_5) E24(IO_L7N_M5BA2_5) E25(IO_L16P_M5DQ4_5) E26(IO_L16N_M5DQ5_5) F22(IO_L4P_M5CKE_5) F24(IO_L18P_M5LDQS_5) F26(IO_L18N_M5LDQSN_5) G19(IO_L9N_M5BA1_5) G20(IO_L2P_M5A13_5) G21(IO_L2N_M5A14_5) G22(IO_L6N_M5A4_5) G23(IO_L8P_M5A7_5) G24(IO_L8N_M5A2_5) G25(IO_L20P_M5DQ0_5) G26(IO_L20N_M5DQ1_5) H18(IO_L9P_M5BA0_5) H19(IO_L27P_5) H20(IO_L5P_M5A8_5) H21(IO_L5N_M5A9_5) H22(IO_L6P_M5A10_5) H24(IO_L19P_M5DQ2_5) H26(IO_L19N_M5DQ3_5) J20(IO_L27N_5) J22(IO_L14N_M5CASN_5) J23(IO_L15P_M5UDM_5) J24(IO_L15N_M5LDM_5) J25(IO_L22P_M5DQ10_5) J26(IO_L22N_M5DQ11_5) K20(IO_L13P_M5A5_5) K21(IO_L13N_M5A6_5) K22(IO_L14P_M5RASN_5) K24(IO_L21P_M5DQ8_5) K26(IO_L21N_M5DQ9_5) L20(IO_L26P_5) L21(IO_L26N_VREF_5) L25(IO_L24P_M5DQ12_5) L26(IO_L24N_M5DQ13_5) M24(IO_L23P_M5UDQS_5) M26(IO_L23N_M5UDQSN_5) N25(IO_L25P_M5DQ14_5) N26(IO_L25N_M5DQ15_5)

### Notes on the sheet
- Sheet Name
- Project Title
- Global Project
- Size
- Group
- Revision
- Date
- Sheet
- of
- Filename
- Designers
- (in symbol FPGA_XC6SLX100-3FGG676C, part F) BANK 5

### Library data of the parts
U1 = FPGA_XC6SLX100-3FGG676C: as U1 on sheet S7CAS-PLEIADES-CARTE-MERE_P01_FPGA-BANK2; Current: *; Power: *; Mfg: Xilinx; Mfg Part Number: XC6SLX100-3FGG676C; HelpURL: https://www.xilinx.com/support/documentation/data_sheets/ds162.pdf; CreatedBy: Jonathan Bouchard; Temperature: 0°C ~ 85°C (TJ); Value: *; Precision: *; Package: BGA-676; Supplier 1: Digikey; Supplier Part Number 1: 122-1760-ND; Part Number #1: XC6SLX100-3FGG676C